# Altium project Front Row.PrjPcb
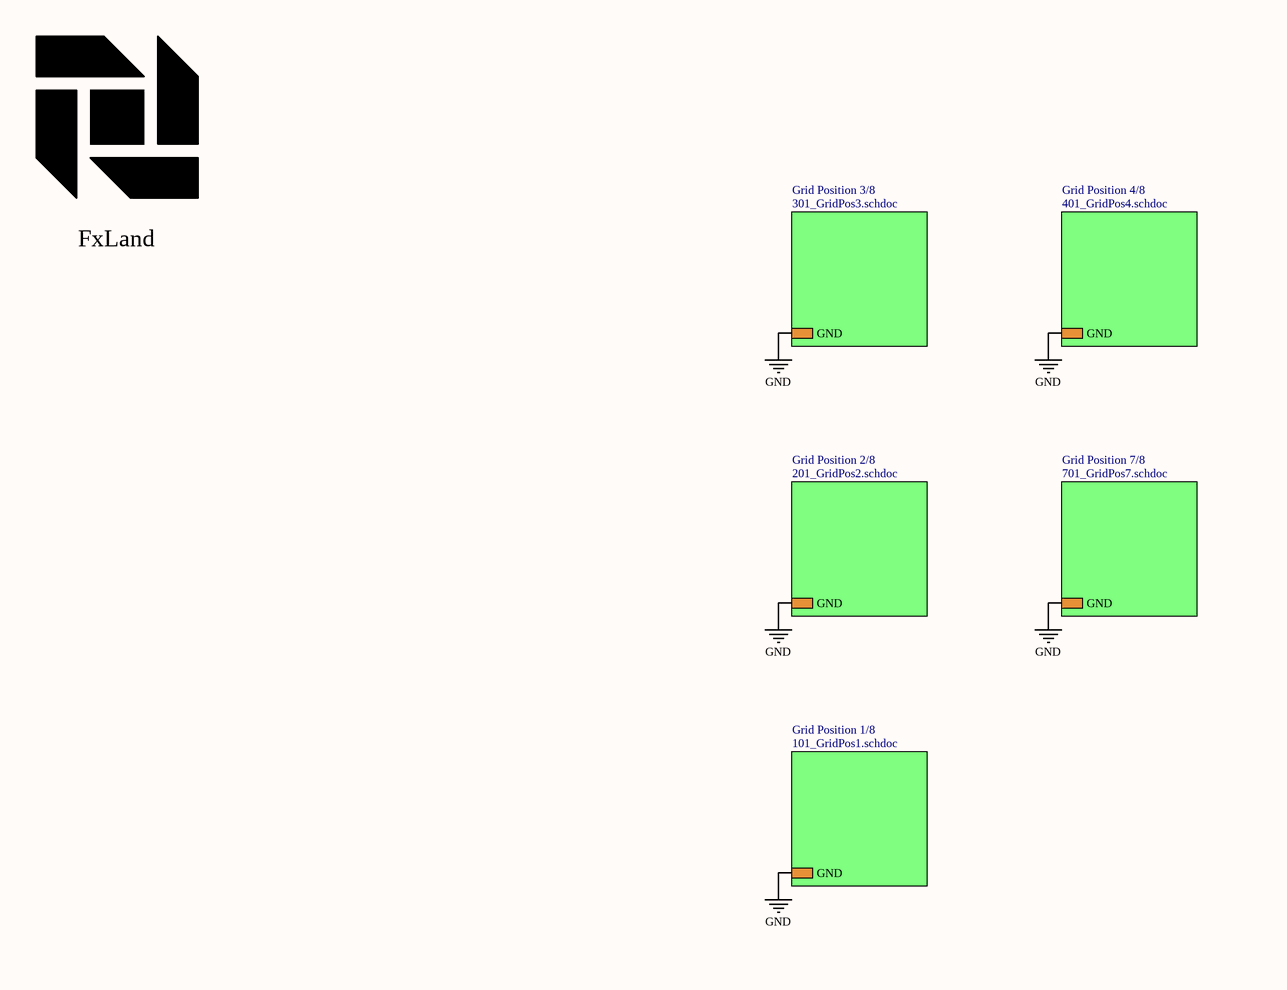
[diagram p0: 100_top.SchDoc, left]
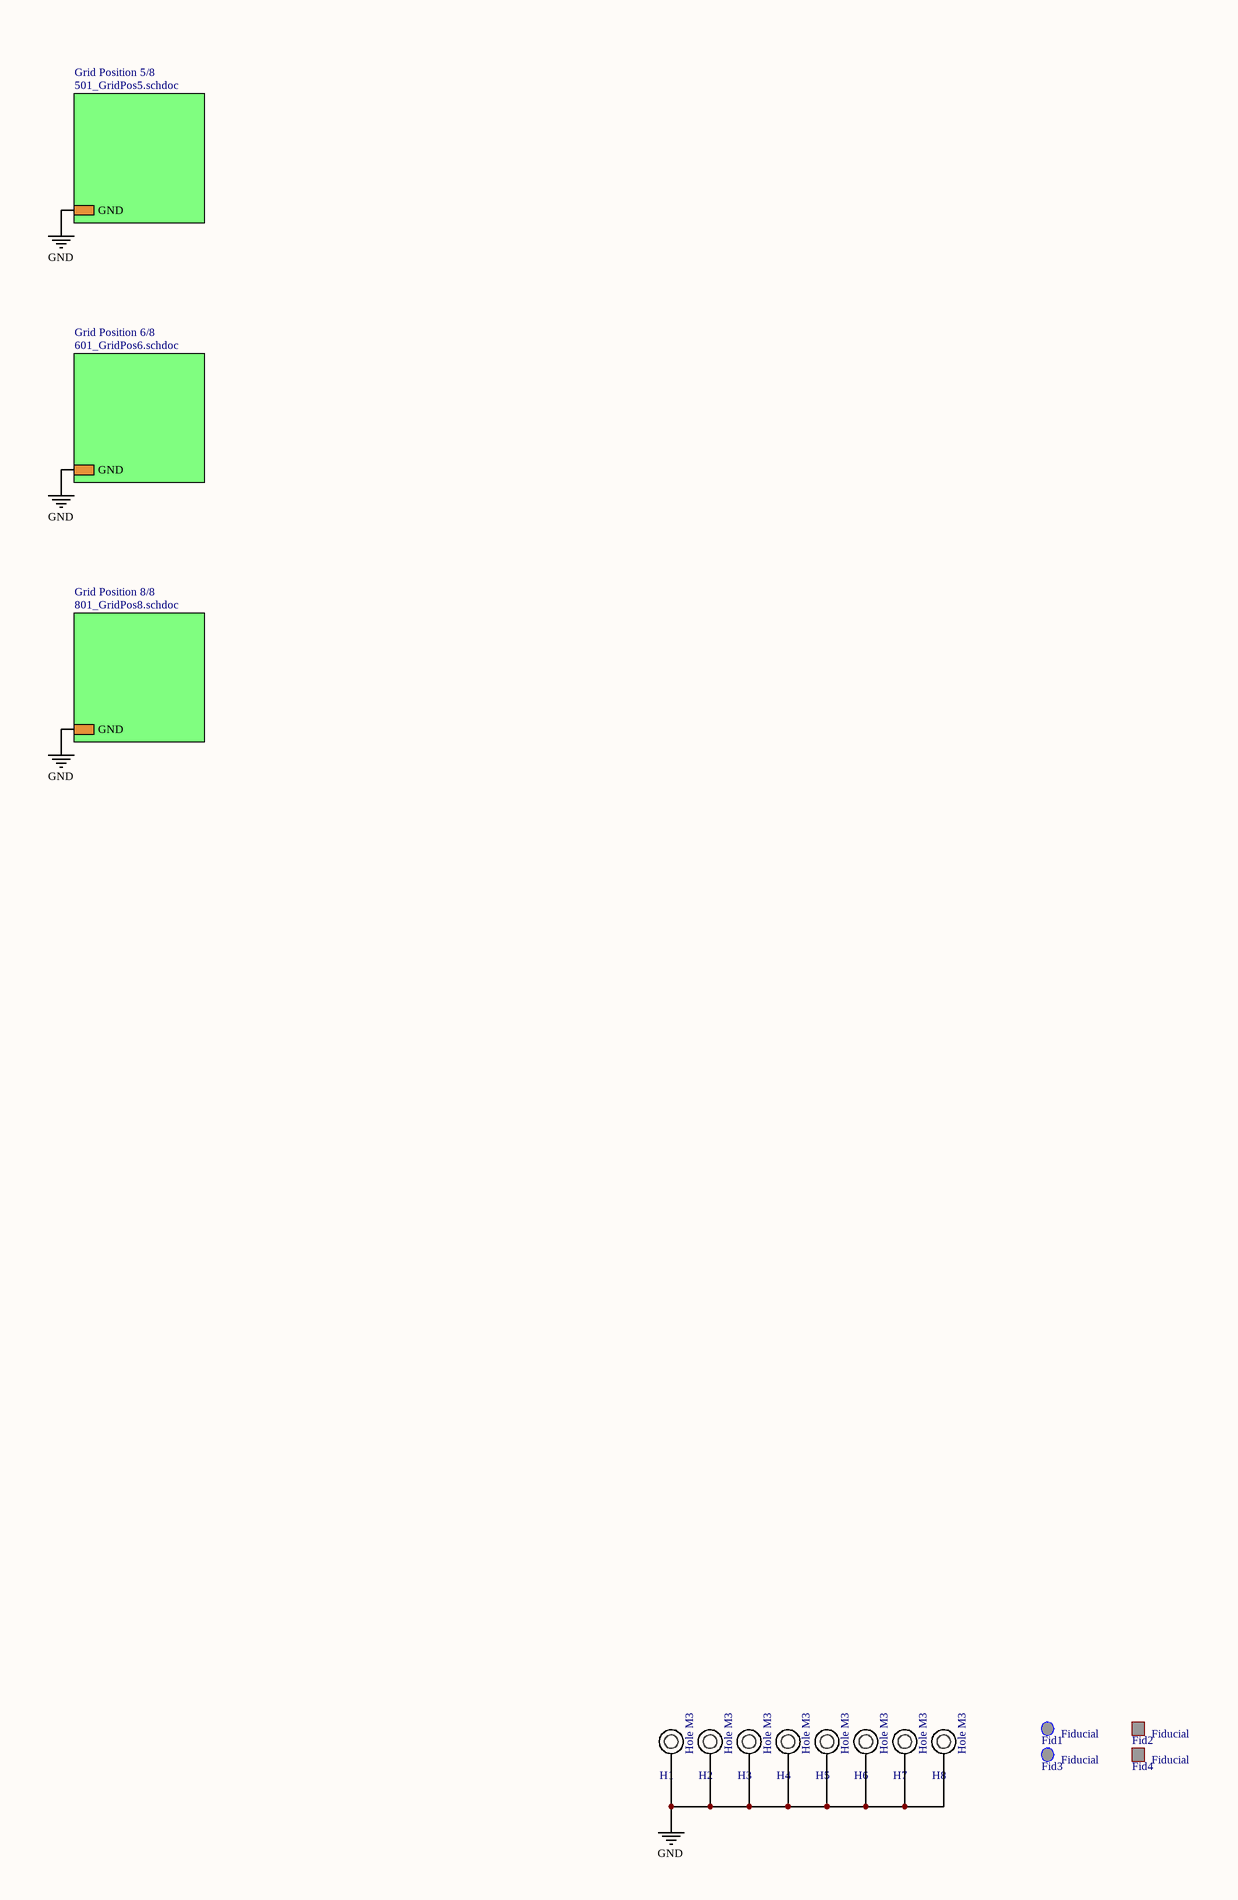
[diagram p1: 100_top.SchDoc, right]
DocNumber: P234; PrName: Grid part 1; Rev: 1.8
9 sheets, 29 parts. Net scope: hierarchical (ports join the sheet entries above them; power ports are global).
Board file: Front Row.PcbDoc
Sheets:
  100_top.SchDoc
    Grid Position 1/8 = 101_GridPos1.SchDoc
    Grid Position 2/8 = 201_GridPos2.SchDoc
    Grid Position 4/8 = 401_GridPos4.SchDoc
    Grid Position 5/8 = 501_GridPos5.SchDoc
    Grid Position 3/8 = 301_GridPos3.SchDoc
    Grid Position 6/8 = 601_GridPos6.SchDoc
    Grid Position 7/8 = 701_GridPos7.SchDoc
    Grid Position 8/8 = 801_GridPos8.SchDoc

## Sheet 100_top.SchDoc
size A2; Organization: Greenfield Tech Solutions; Address1: Molendreef 33; Address2: Ossendrecht; Address3: 4641CS; Address4: The Netherlands; DocumentNumber: P234; Revision: 1.8; SheetNumber: 1; SheetTotal: 9

### Parts
Fid1  Fiducial  [FidR_1.0mm]
Fid2  Fiducial  [FidS_1.0mm]
Fid3  Fiducial  [FidR_1.0mm]
Fid4  Fiducial  [FidS_1.0mm]
H1  Hole M3  [HOLE_M3]
H2  Hole M3  [HOLE_M3]
H3  Hole M3  [HOLE_M3]
H4  Hole M3  [HOLE_M3]
H5  Hole M3  [HOLE_M3]
H6  Hole M3  [HOLE_M3]
H7  Hole M3  [HOLE_M3]
H8  Hole M3  [HOLE_M3]
Logo_FxLand1  FxLand  [Logo_FxLand_3]  (value not drawn)

### Sub-sheets
Grid Position 1/8 = 101_GridPos1.schdoc: GND
Grid Position 2/8 = 201_GridPos2.schdoc: GND
Grid Position 3/8 = 301_GridPos3.schdoc: GND
Grid Position 4/8 = 401_GridPos4.schdoc: GND
Grid Position 5/8 = 501_GridPos5.schdoc: GND
Grid Position 6/8 = 601_GridPos6.schdoc: GND
Grid Position 7/8 = 701_GridPos7.schdoc: GND
Grid Position 8/8 = 801_GridPos8.schdoc: GND

### Nets
GND: H1.1 H2.1 H3.1 H4.1 H5.1 H6.1 H7.1 H8.1 ; sheet Grid Position 1/8/GND, sheet Grid Position 2/8/GND, sheet Grid Position 4/8/GND, sheet Grid Position 5/8/GND, sheet Grid Position 3/8/GND, sheet Grid Position 6/8/GND, sheet Grid Position 7/8/GND, sheet Grid Position 8/8/GND

### Notes on the sheet
- Title
- Size:
- Date:
- File:
- A2
- Number:
- Time:
- Revision:
- Sheet
- of

### Library data of the parts
Fid1 Fid3 = ME0011: Fiducial Round 1mm; Part Number: ME0011; ID: 11; RefVal: Fiducial
Fid2 Fid4 = ME0012: Fiducial Sqaure 1mm; Part Number: ME0012; ID: 12; RefVal: Fiducial
H1-H8 = ME0001: Mounting Hole M3; Part Number: ME0001; ID: 1; RefVal: Hole M3
Logo_FxLand1 = ME0008: Logo FxLand 3; Part Number: ME0008; ID: 8; RefVal: FxLand

## Sheet 101_GridPos1.SchDoc: Grid Position 1 / USB 0
size A2; Organization: Greenfield Tech Solutions; Address1: Molendreef 33; Address2: Ossendrecht; Address3: 4641CS; Address4: The Netherlands; DocumentNumber: P234; Revision: 1.8; SheetNumber: 2; SheetTotal: 9
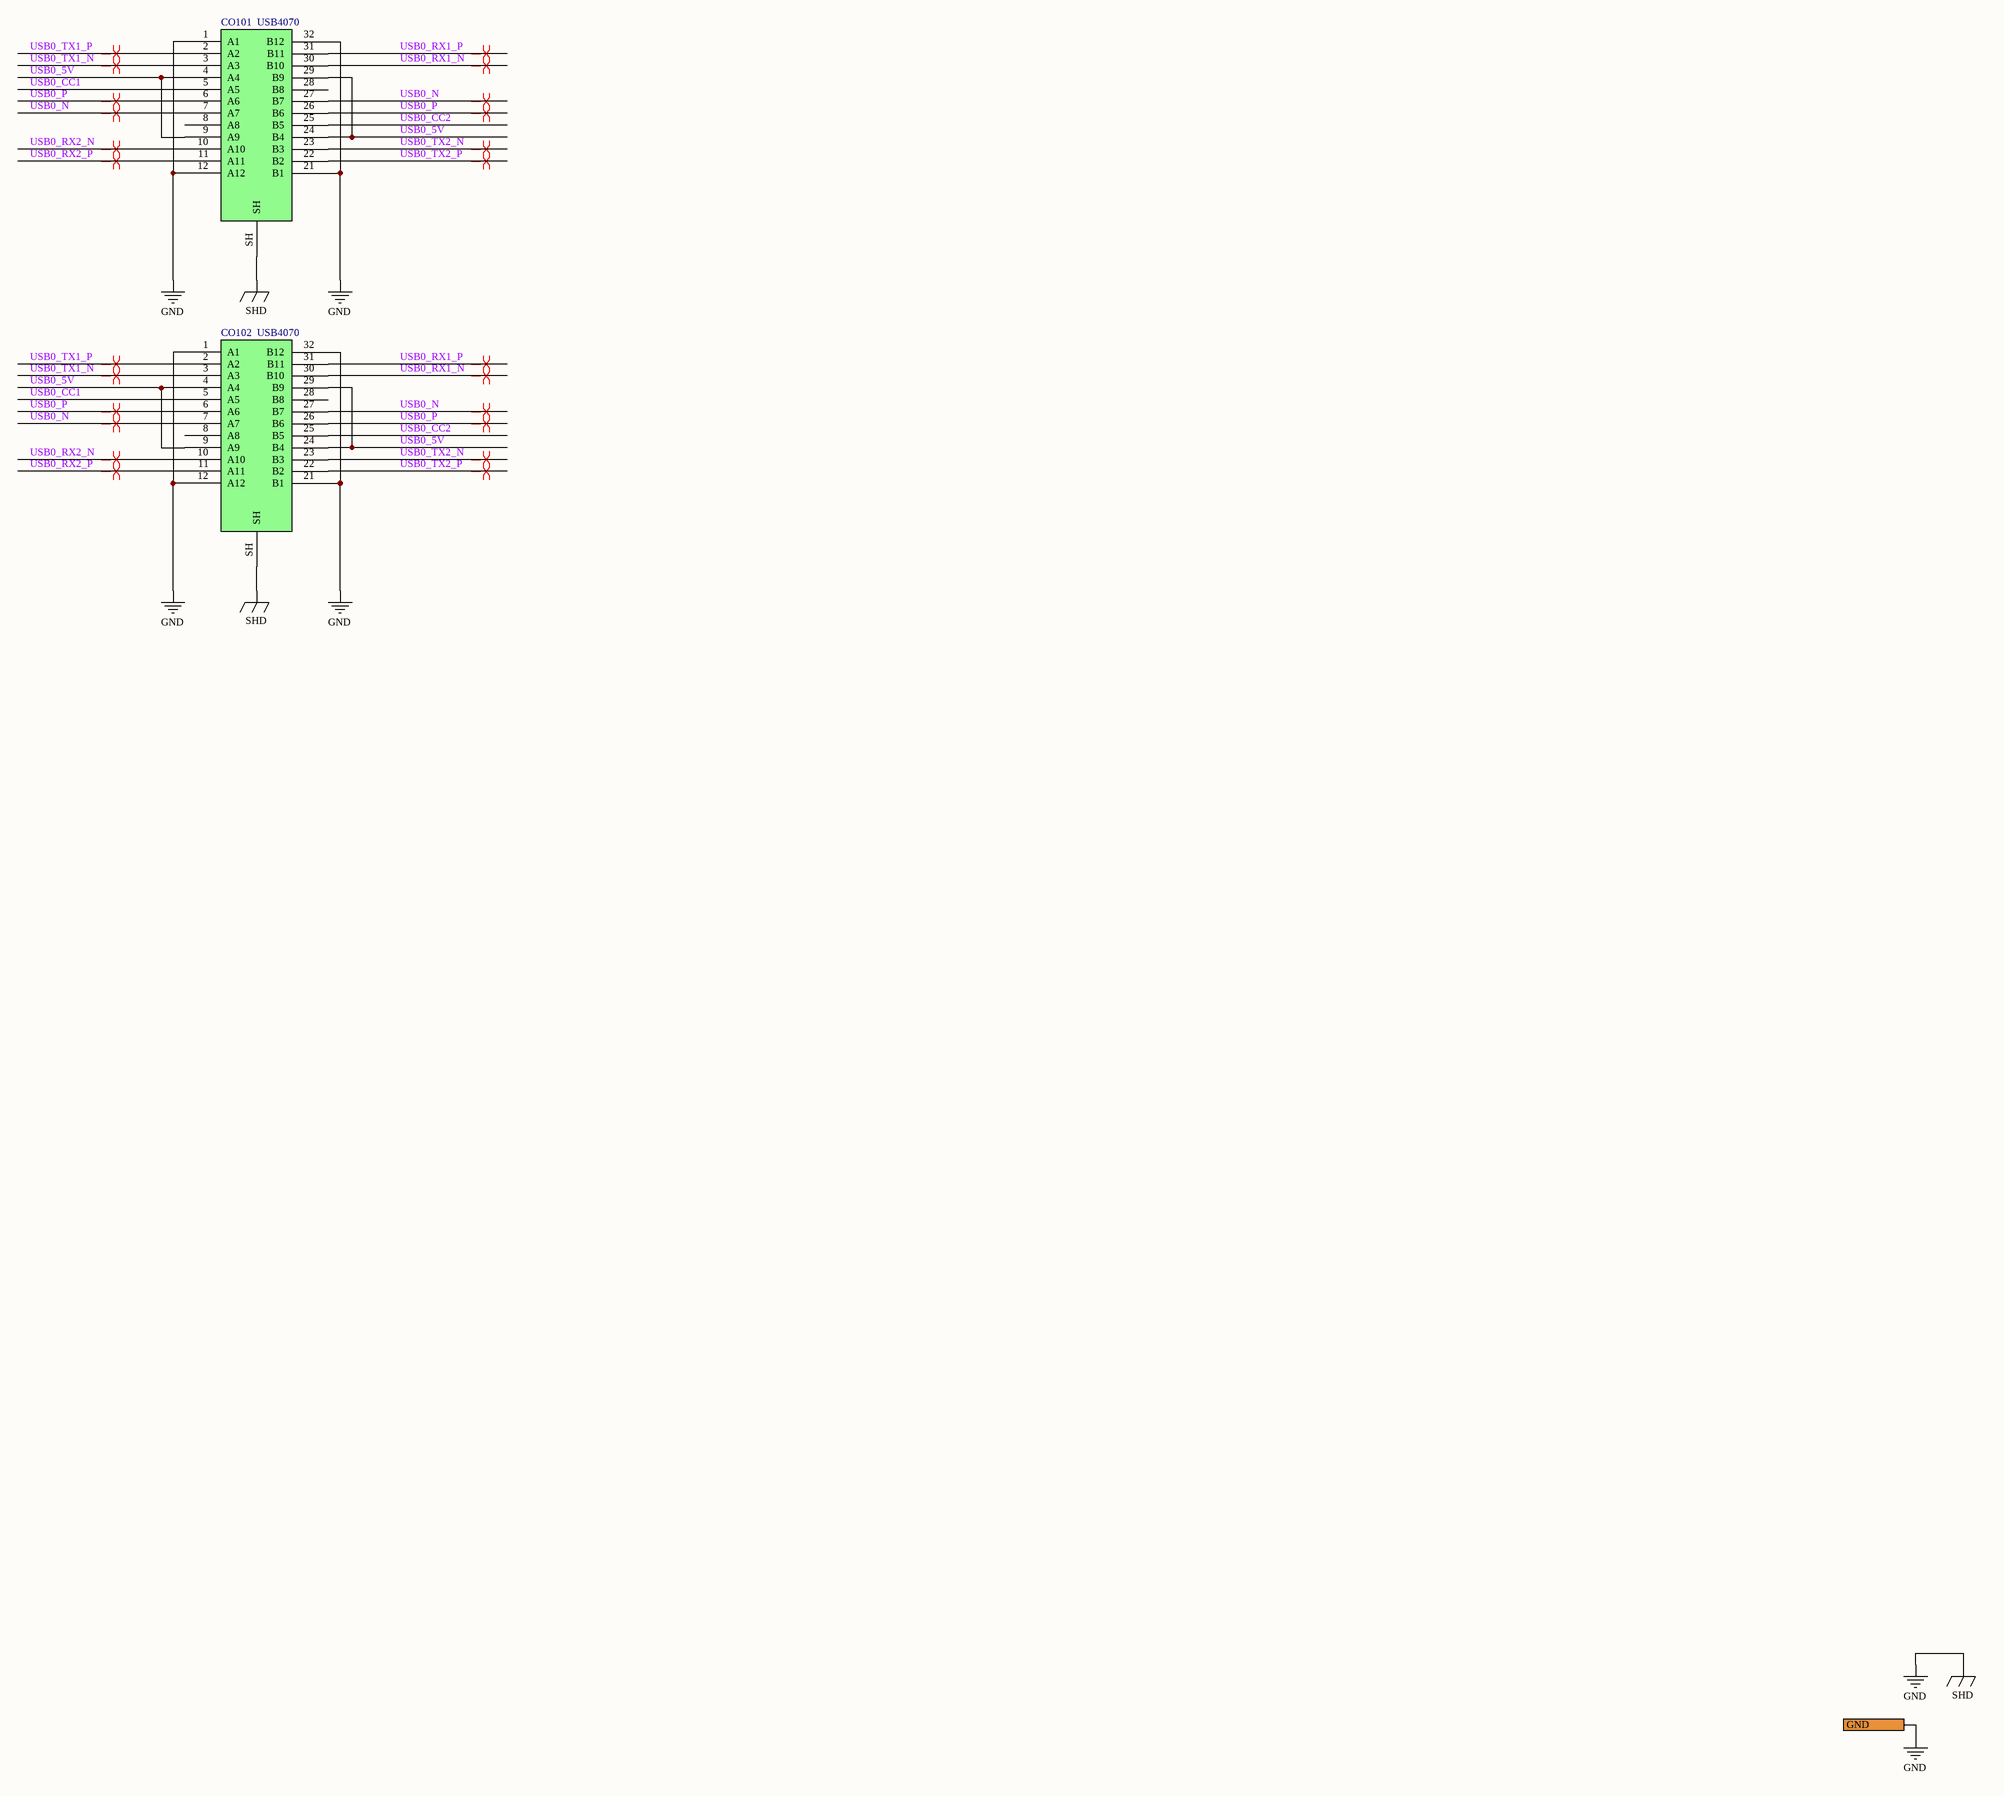
[diagram p2: 101_GridPos1.SchDoc]

### Parts
CO101  USB4070  [USB4070-30-C]
CO102  USB4070  [USB4070-30-C]

### Ports
GND

### Nets
GND: CO101.1(A1) CO101.12(A12) CO101.21(B1) CO101.32(B12) CO101.SH CO102.1(A1) CO102.12(A12) CO102.21(B1) CO102.32(B12) CO102.SH ; port GND  [also labelled SHD]
USB0_5V: CO101.4(A4) CO101.9(A9) CO101.24(B4) CO101.29(B9) CO102.4(A4) CO102.9(A9) CO102.24(B4) CO102.29(B9)
USB0_CC1: CO101.5(A5) CO102.5(A5)
USB0_CC2: CO101.25(B5) CO102.25(B5)
USB0_N: CO101.7(A7) CO101.27(B7) CO102.7(A7) CO102.27(B7)
USB0_P: CO101.6(A6) CO101.26(B6) CO102.6(A6) CO102.26(B6)
USB0_RX1_N: CO101.30(B10) CO102.30(B10)
USB0_RX1_P: CO101.31(B11) CO102.31(B11)
USB0_RX2_N: CO101.10(A10) CO102.10(A10)
USB0_RX2_P: CO101.11(A11) CO102.11(A11)
USB0_TX1_N: CO101.3(A3) CO102.3(A3)
USB0_TX1_P: CO101.2(A2) CO102.2(A2)
USB0_TX2_N: CO101.23(B3) CO102.23(B3)
USB0_TX2_P: CO101.22(B2) CO102.22(B2)

Not connected (* = marked no-connect by the designer): CO101 8(A8) 28(B8); CO102 8(A8) 28(B8)

### Layout directives
differential pair; differential pair class USB3: USB0_N, USB0_P, USB0_RX1_N, USB0_RX1_P, USB0_RX2_N, USB0_RX2_P, USB0_TX1_N, USB0_TX1_P, USB0_TX2_N, USB0_TX2_P

### Notes on the sheet
- Title
- Size:
- Date:
- File:
- A2
- Number:
- Time:
- Revision:
- Sheet
- of

### Library data of the parts
CO101 CO102 = CO0021: USB4070-30-C; Part Number: CO0021; ID: 16; RefVal: USB4070; ManfactPart: USB4070-30-C

## Sheet 201_GridPos2.SchDoc: Grid Position 2 / USB 1
size A2; Organization: Greenfield Tech Solutions; Address1: Molendreef 33; Address2: Ossendrecht; Address3: 4641CS; Address4: The Netherlands; DocumentNumber: P234; Revision: 1.8; SheetNumber: 3; SheetTotal: 9
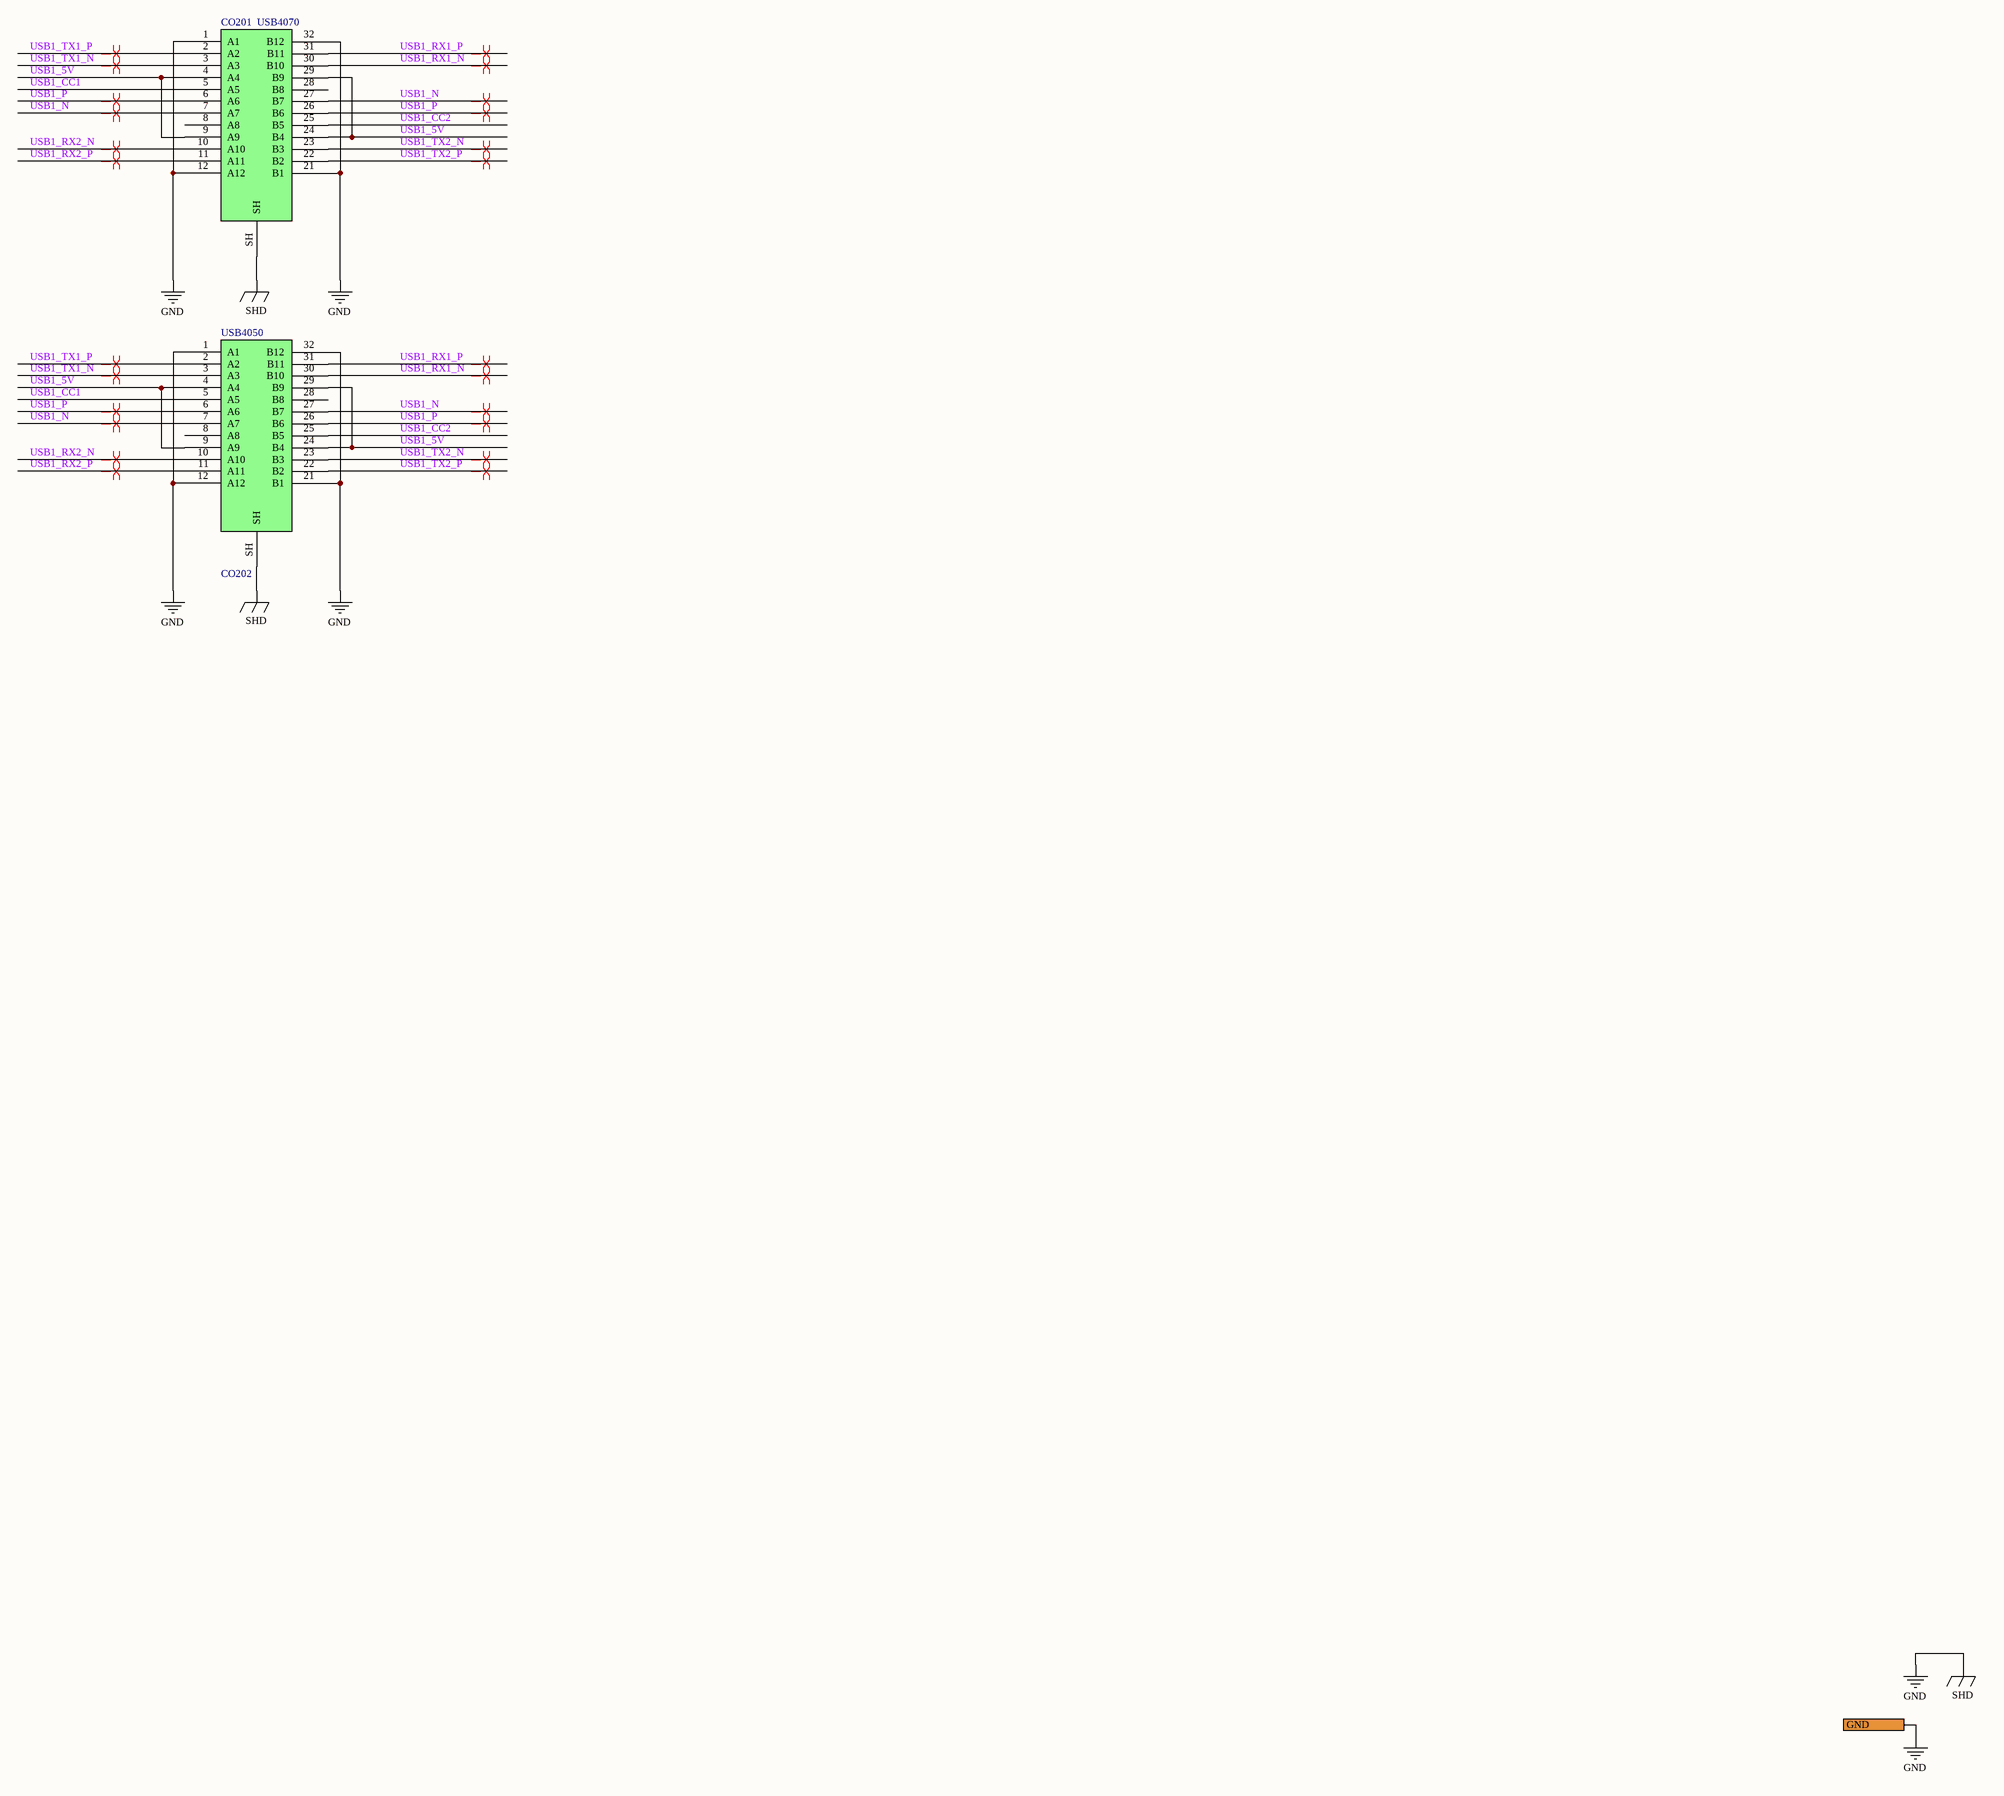
[diagram p3: 201_GridPos2.SchDoc]

### Parts
CO201  USB4070  [USB4070-30-C]
CO202  USB4050  [USB4050-30-A]

### Ports
GND

### Nets
GND: CO201.1(A1) CO201.12(A12) CO201.21(B1) CO201.32(B12) CO201.SH CO202.1(A1) CO202.12(A12) CO202.21(B1) CO202.32(B12) CO202.SH ; port GND  [also labelled SHD]
USB1_5V: CO201.4(A4) CO201.9(A9) CO201.24(B4) CO201.29(B9) CO202.4(A4) CO202.9(A9) CO202.24(B4) CO202.29(B9)
USB1_CC1: CO201.5(A5) CO202.5(A5)
USB1_CC2: CO201.25(B5) CO202.25(B5)
USB1_N: CO201.7(A7) CO201.27(B7) CO202.7(A7) CO202.27(B7)
USB1_P: CO201.6(A6) CO201.26(B6) CO202.6(A6) CO202.26(B6)
USB1_RX1_N: CO201.30(B10) CO202.30(B10)
USB1_RX1_P: CO201.31(B11) CO202.31(B11)
USB1_RX2_N: CO201.10(A10) CO202.10(A10)
USB1_RX2_P: CO201.11(A11) CO202.11(A11)
USB1_TX1_N: CO201.3(A3) CO202.3(A3)
USB1_TX1_P: CO201.2(A2) CO202.2(A2)
USB1_TX2_N: CO201.23(B3) CO202.23(B3)
USB1_TX2_P: CO201.22(B2) CO202.22(B2)

Not connected (* = marked no-connect by the designer): CO201 8(A8) 28(B8); CO202 8(A8) 28(B8)

### Layout directives
differential pair; differential pair class USB3: USB1_N, USB1_P, USB1_RX1_N, USB1_RX1_P, USB1_RX2_N, USB1_RX2_P, USB1_TX1_N, USB1_TX1_P, USB1_TX2_N, USB1_TX2_P

### Notes on the sheet
- Title
- Size:
- Date:
- File:
- A2
- Number:
- Time:
- Revision:
- Sheet
- of

### Library data of the parts
CO201 = CO0021: as CO101 on sheet 101_GridPos1; RefVal: USB4070; ManfactPart: USB4070-30-C
CO202 = CO0039: USB C connector Receptacle Horizontal; Part Number: CO0039; ID: 39; RefVal: USB4050; ManfactPart: USB4050-30-A

## Sheet 401_GridPos4.SchDoc: Grid Position 4 / USB 3
size A2; Organization: Greenfield Tech Solutions; Address1: Molendreef 33; Address2: Ossendrecht; Address3: 4641CS; Address4: The Netherlands; DocumentNumber: P234; Revision: 1.8; SheetNumber: 5; SheetTotal: 9
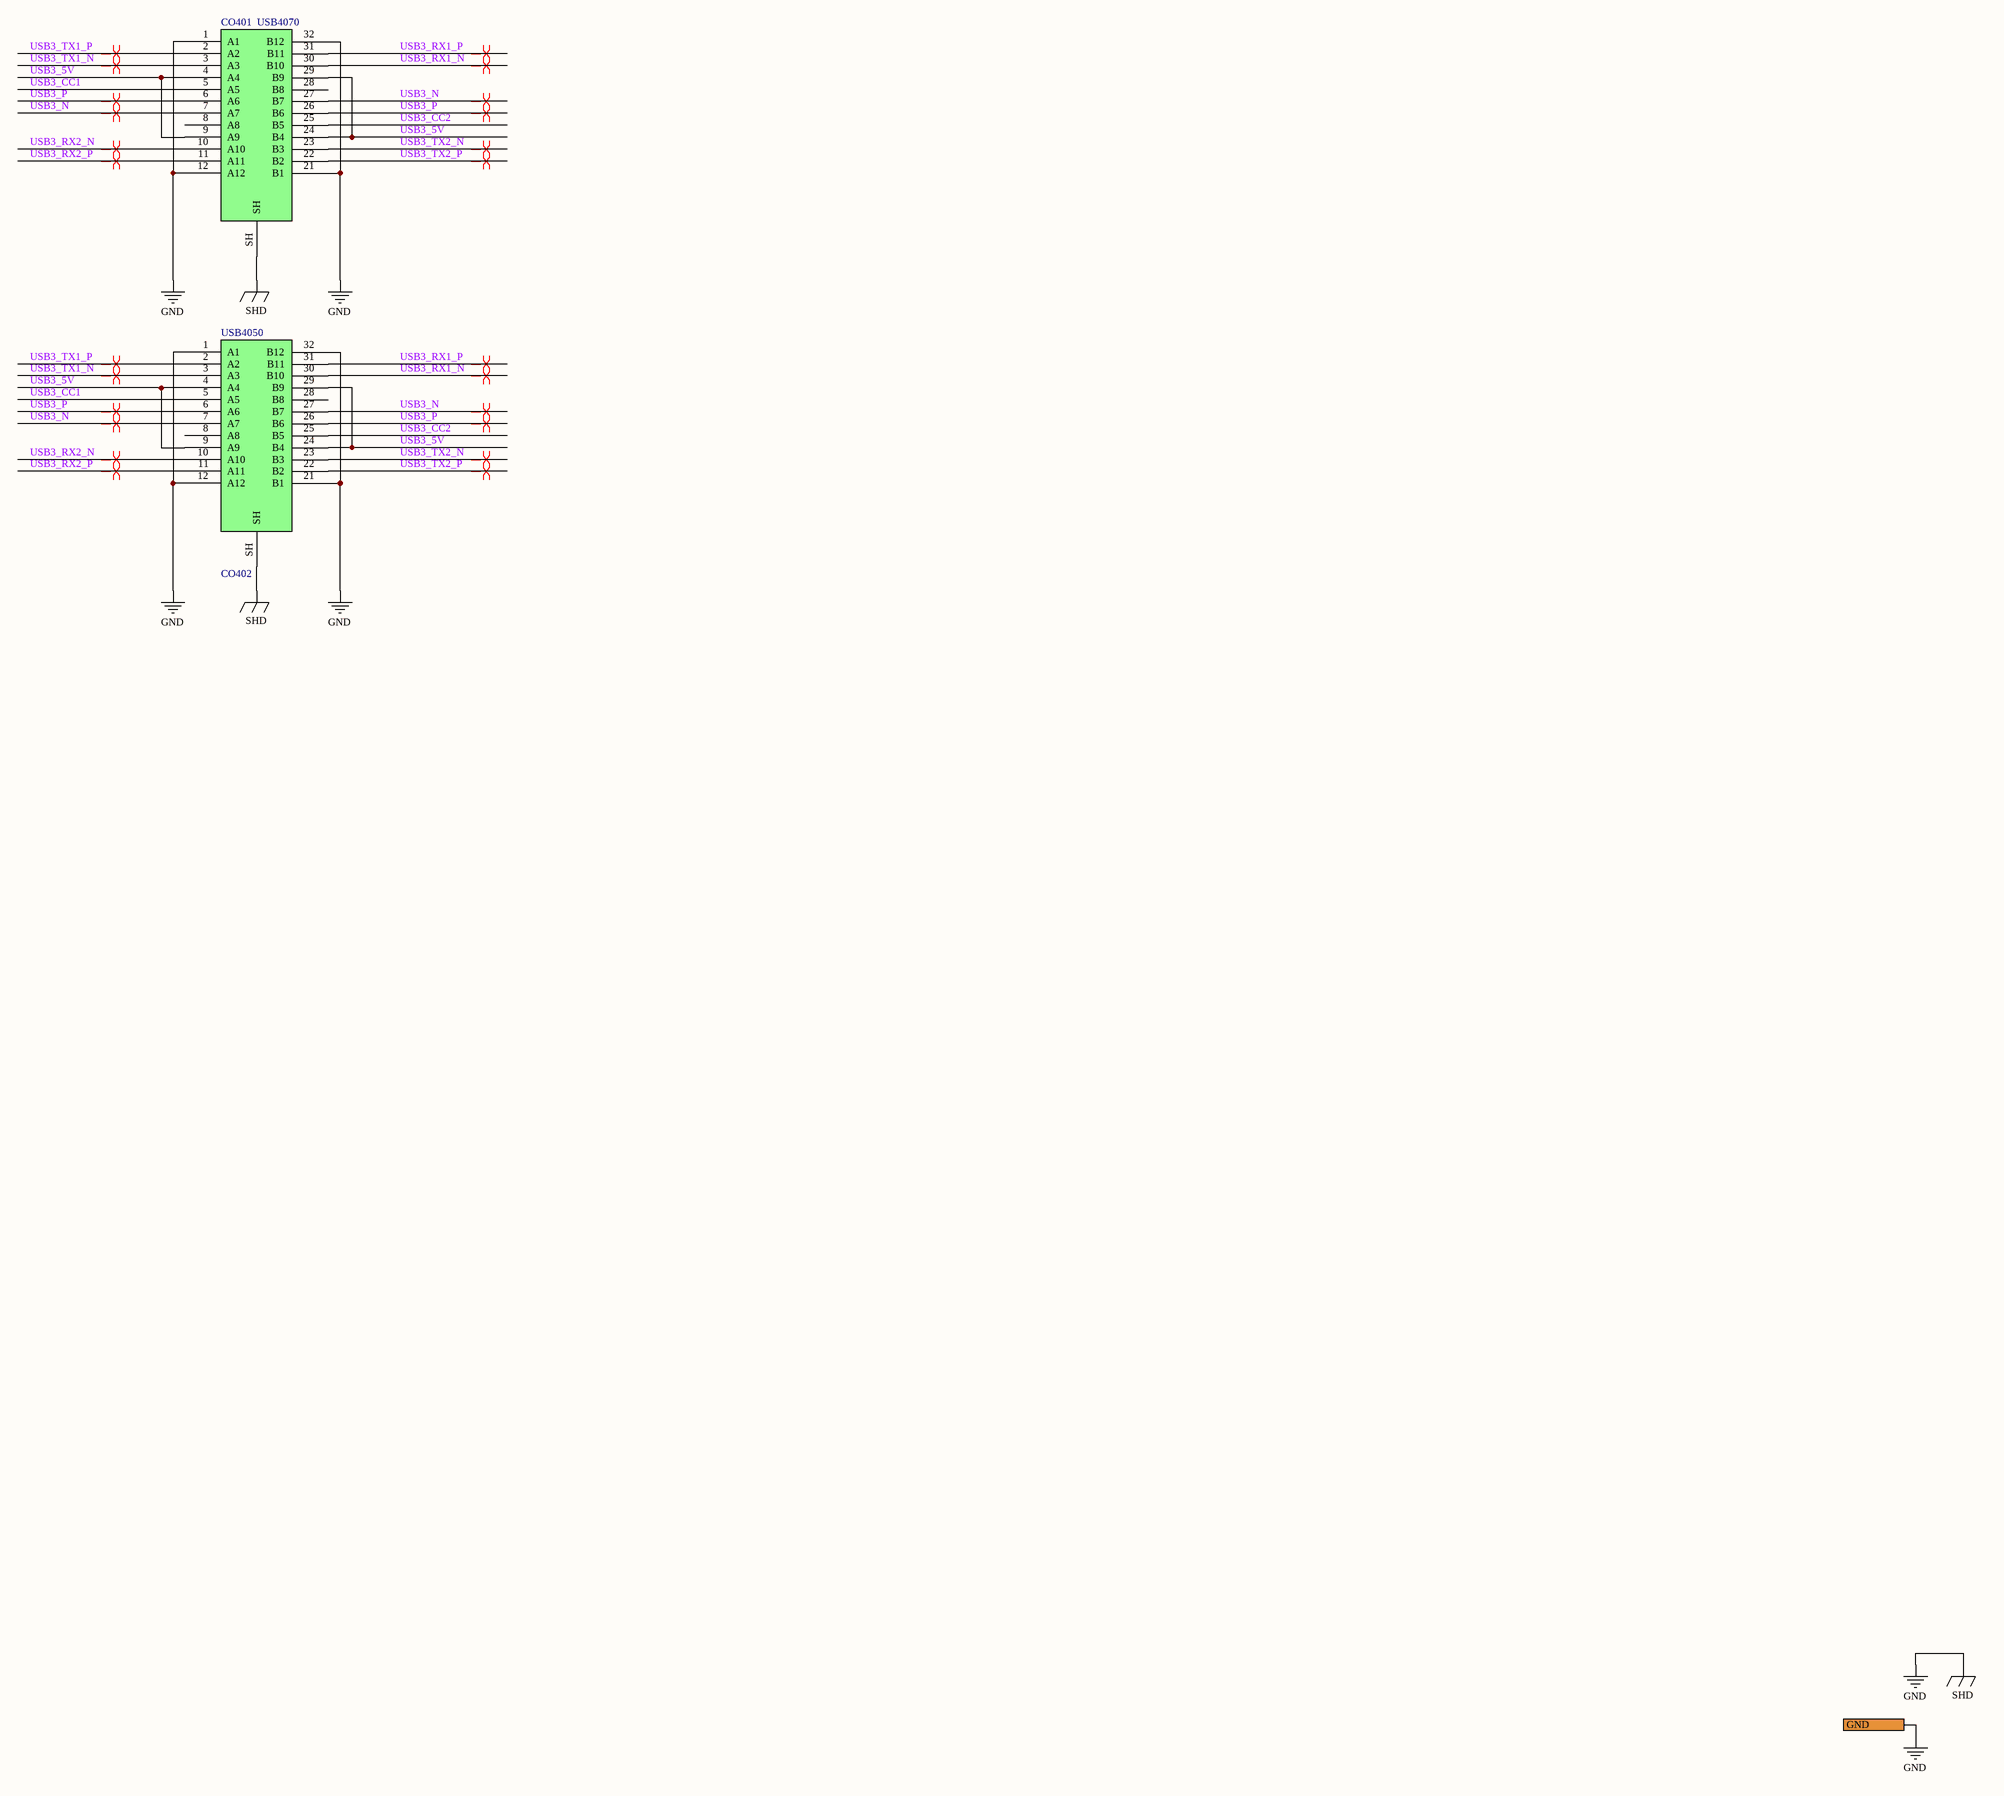
[diagram p4: 401_GridPos4.SchDoc]

### Parts
CO401  USB4070  [USB4070-30-C]
CO402  USB4050  [USB4050-30-A]

### Ports
GND

### Nets
GND: CO401.1(A1) CO401.12(A12) CO401.21(B1) CO401.32(B12) CO401.SH CO402.1(A1) CO402.12(A12) CO402.21(B1) CO402.32(B12) CO402.SH ; port GND  [also labelled SHD]
USB3_5V: CO401.4(A4) CO401.9(A9) CO401.24(B4) CO401.29(B9) CO402.4(A4) CO402.9(A9) CO402.24(B4) CO402.29(B9)
USB3_CC1: CO401.5(A5) CO402.5(A5)
USB3_CC2: CO401.25(B5) CO402.25(B5)
USB3_N: CO401.7(A7) CO401.27(B7) CO402.7(A7) CO402.27(B7)
USB3_P: CO401.6(A6) CO401.26(B6) CO402.6(A6) CO402.26(B6)
USB3_RX1_N: CO401.30(B10) CO402.30(B10)
USB3_RX1_P: CO401.31(B11) CO402.31(B11)
USB3_RX2_N: CO401.10(A10) CO402.10(A10)
USB3_RX2_P: CO401.11(A11) CO402.11(A11)
USB3_TX1_N: CO401.3(A3) CO402.3(A3)
USB3_TX1_P: CO401.2(A2) CO402.2(A2)
USB3_TX2_N: CO401.23(B3) CO402.23(B3)
USB3_TX2_P: CO401.22(B2) CO402.22(B2)

Not connected (* = marked no-connect by the designer): CO401 8(A8) 28(B8); CO402 8(A8) 28(B8)

### Layout directives
differential pair; differential pair class USB3: USB3_N, USB3_P, USB3_RX1_N, USB3_RX1_P, USB3_RX2_N, USB3_RX2_P, USB3_TX1_N, USB3_TX1_P, USB3_TX2_N, USB3_TX2_P

### Notes on the sheet
- Title
- Size:
- Date:
- File:
- A2
- Number:
- Time:
- Revision:
- Sheet
- of

### Library data of the parts
CO401 = CO0021: as CO101 on sheet 101_GridPos1; RefVal: USB4070; ManfactPart: USB4070-30-C
CO402 = CO0039: as CO202 on sheet 201_GridPos2; RefVal: USB4050; ManfactPart: USB4050-30-A

## Sheet 501_GridPos5.SchDoc: Grid Position 5 / USB 4
size A2; Organization: Greenfield Tech Solutions; Address1: Molendreef 33; Address2: Ossendrecht; Address3: 4641CS; Address4: The Netherlands; DocumentNumber: P234; Revision: 1.8; SheetNumber: 6; SheetTotal: 9
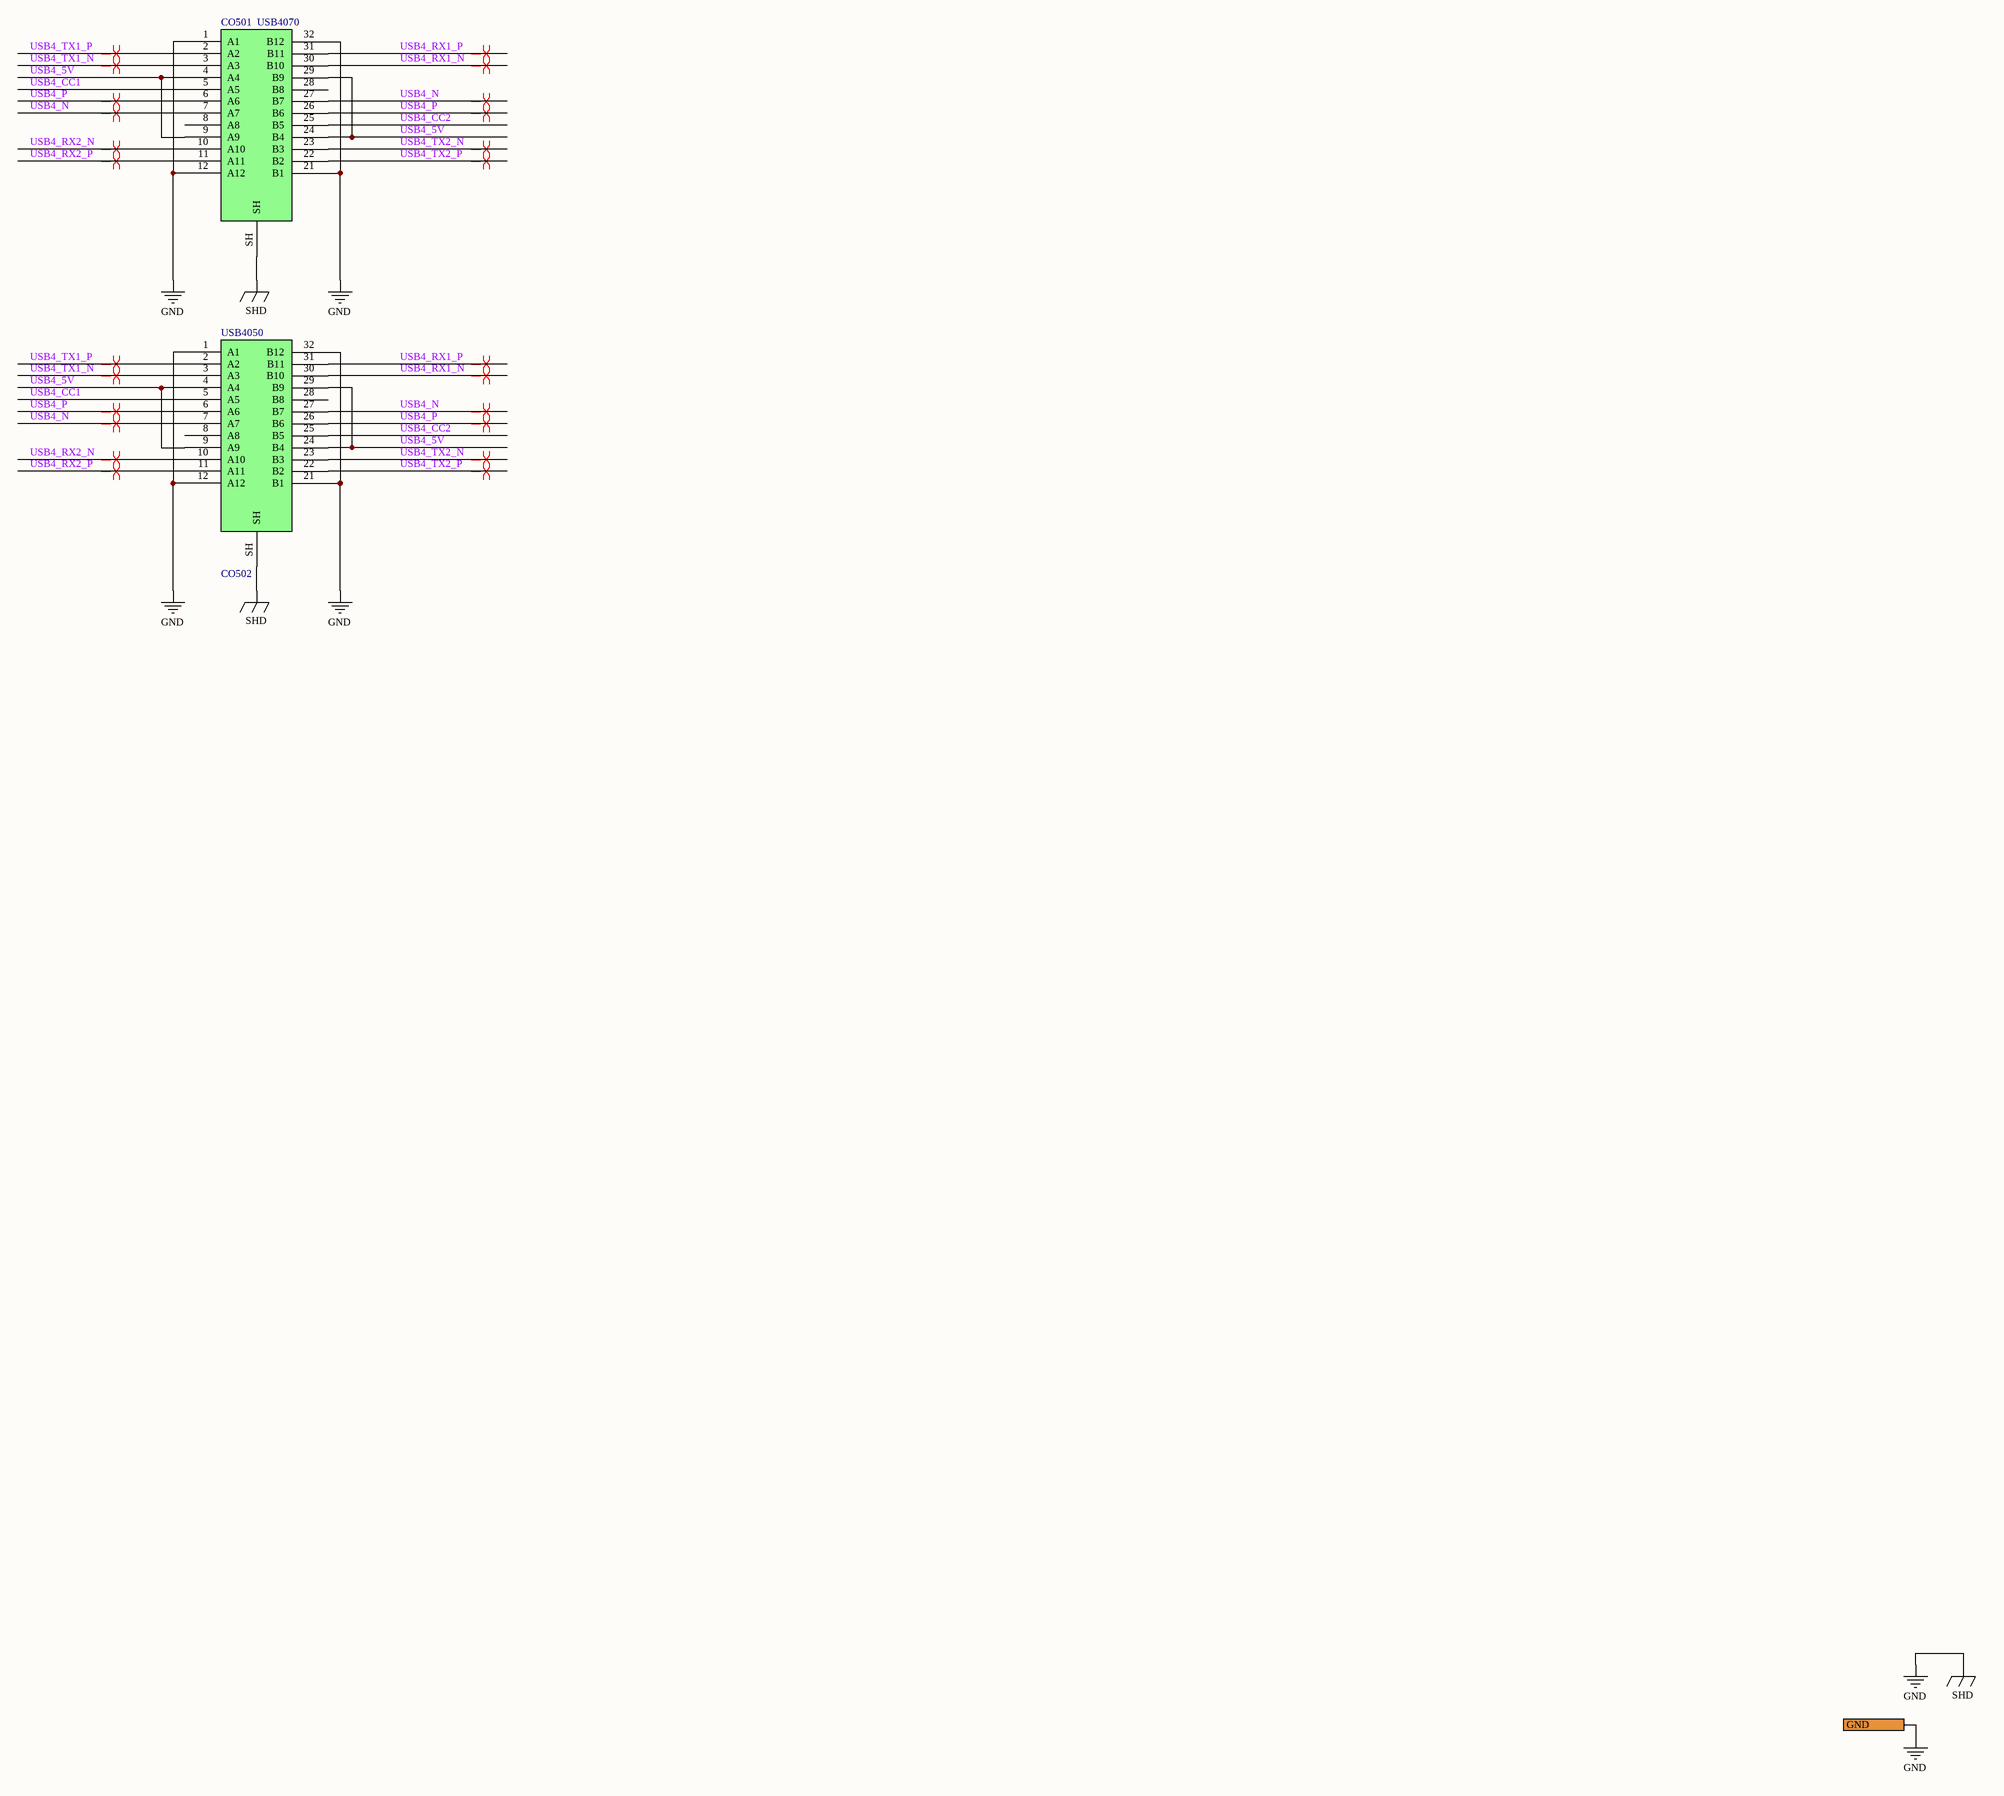
[diagram p5: 501_GridPos5.SchDoc]

### Parts
CO501  USB4070  [USB4070-30-C]
CO502  USB4050  [USB4050-30-A]

### Ports
GND

### Nets
GND: CO501.1(A1) CO501.12(A12) CO501.21(B1) CO501.32(B12) CO501.SH CO502.1(A1) CO502.12(A12) CO502.21(B1) CO502.32(B12) CO502.SH ; port GND  [also labelled SHD]
USB4_5V: CO501.4(A4) CO501.9(A9) CO501.24(B4) CO501.29(B9) CO502.4(A4) CO502.9(A9) CO502.24(B4) CO502.29(B9)
USB4_CC1: CO501.5(A5) CO502.5(A5)
USB4_CC2: CO501.25(B5) CO502.25(B5)
USB4_N: CO501.7(A7) CO501.27(B7) CO502.7(A7) CO502.27(B7)
USB4_P: CO501.6(A6) CO501.26(B6) CO502.6(A6) CO502.26(B6)
USB4_RX1_N: CO501.30(B10) CO502.30(B10)
USB4_RX1_P: CO501.31(B11) CO502.31(B11)
USB4_RX2_N: CO501.10(A10) CO502.10(A10)
USB4_RX2_P: CO501.11(A11) CO502.11(A11)
USB4_TX1_N: CO501.3(A3) CO502.3(A3)
USB4_TX1_P: CO501.2(A2) CO502.2(A2)
USB4_TX2_N: CO501.23(B3) CO502.23(B3)
USB4_TX2_P: CO501.22(B2) CO502.22(B2)

Not connected (* = marked no-connect by the designer): CO501 8(A8) 28(B8); CO502 8(A8) 28(B8)

### Layout directives
differential pair; differential pair class USB3: USB4_N, USB4_P, USB4_RX1_N, USB4_RX1_P, USB4_RX2_N, USB4_RX2_P, USB4_TX1_N, USB4_TX1_P, USB4_TX2_N, USB4_TX2_P

### Notes on the sheet
- Title
- Size:
- Date:
- File:
- A2
- Number:
- Time:
- Revision:
- Sheet
- of

### Library data of the parts
CO501 = CO0021: as CO101 on sheet 101_GridPos1; RefVal: USB4070; ManfactPart: USB4070-30-C
CO502 = CO0039: as CO202 on sheet 201_GridPos2; RefVal: USB4050; ManfactPart: USB4050-30-A

## Sheet 301_GridPos3.SchDoc: Grid Position 3 / USB 2
size A2; Organization: Greenfield Tech Solutions; Address1: Molendreef 33; Address2: Ossendrecht; Address3: 4641CS; Address4: The Netherlands; DocumentNumber: P234; Revision: 1.8; SheetNumber: 4; SheetTotal: 9
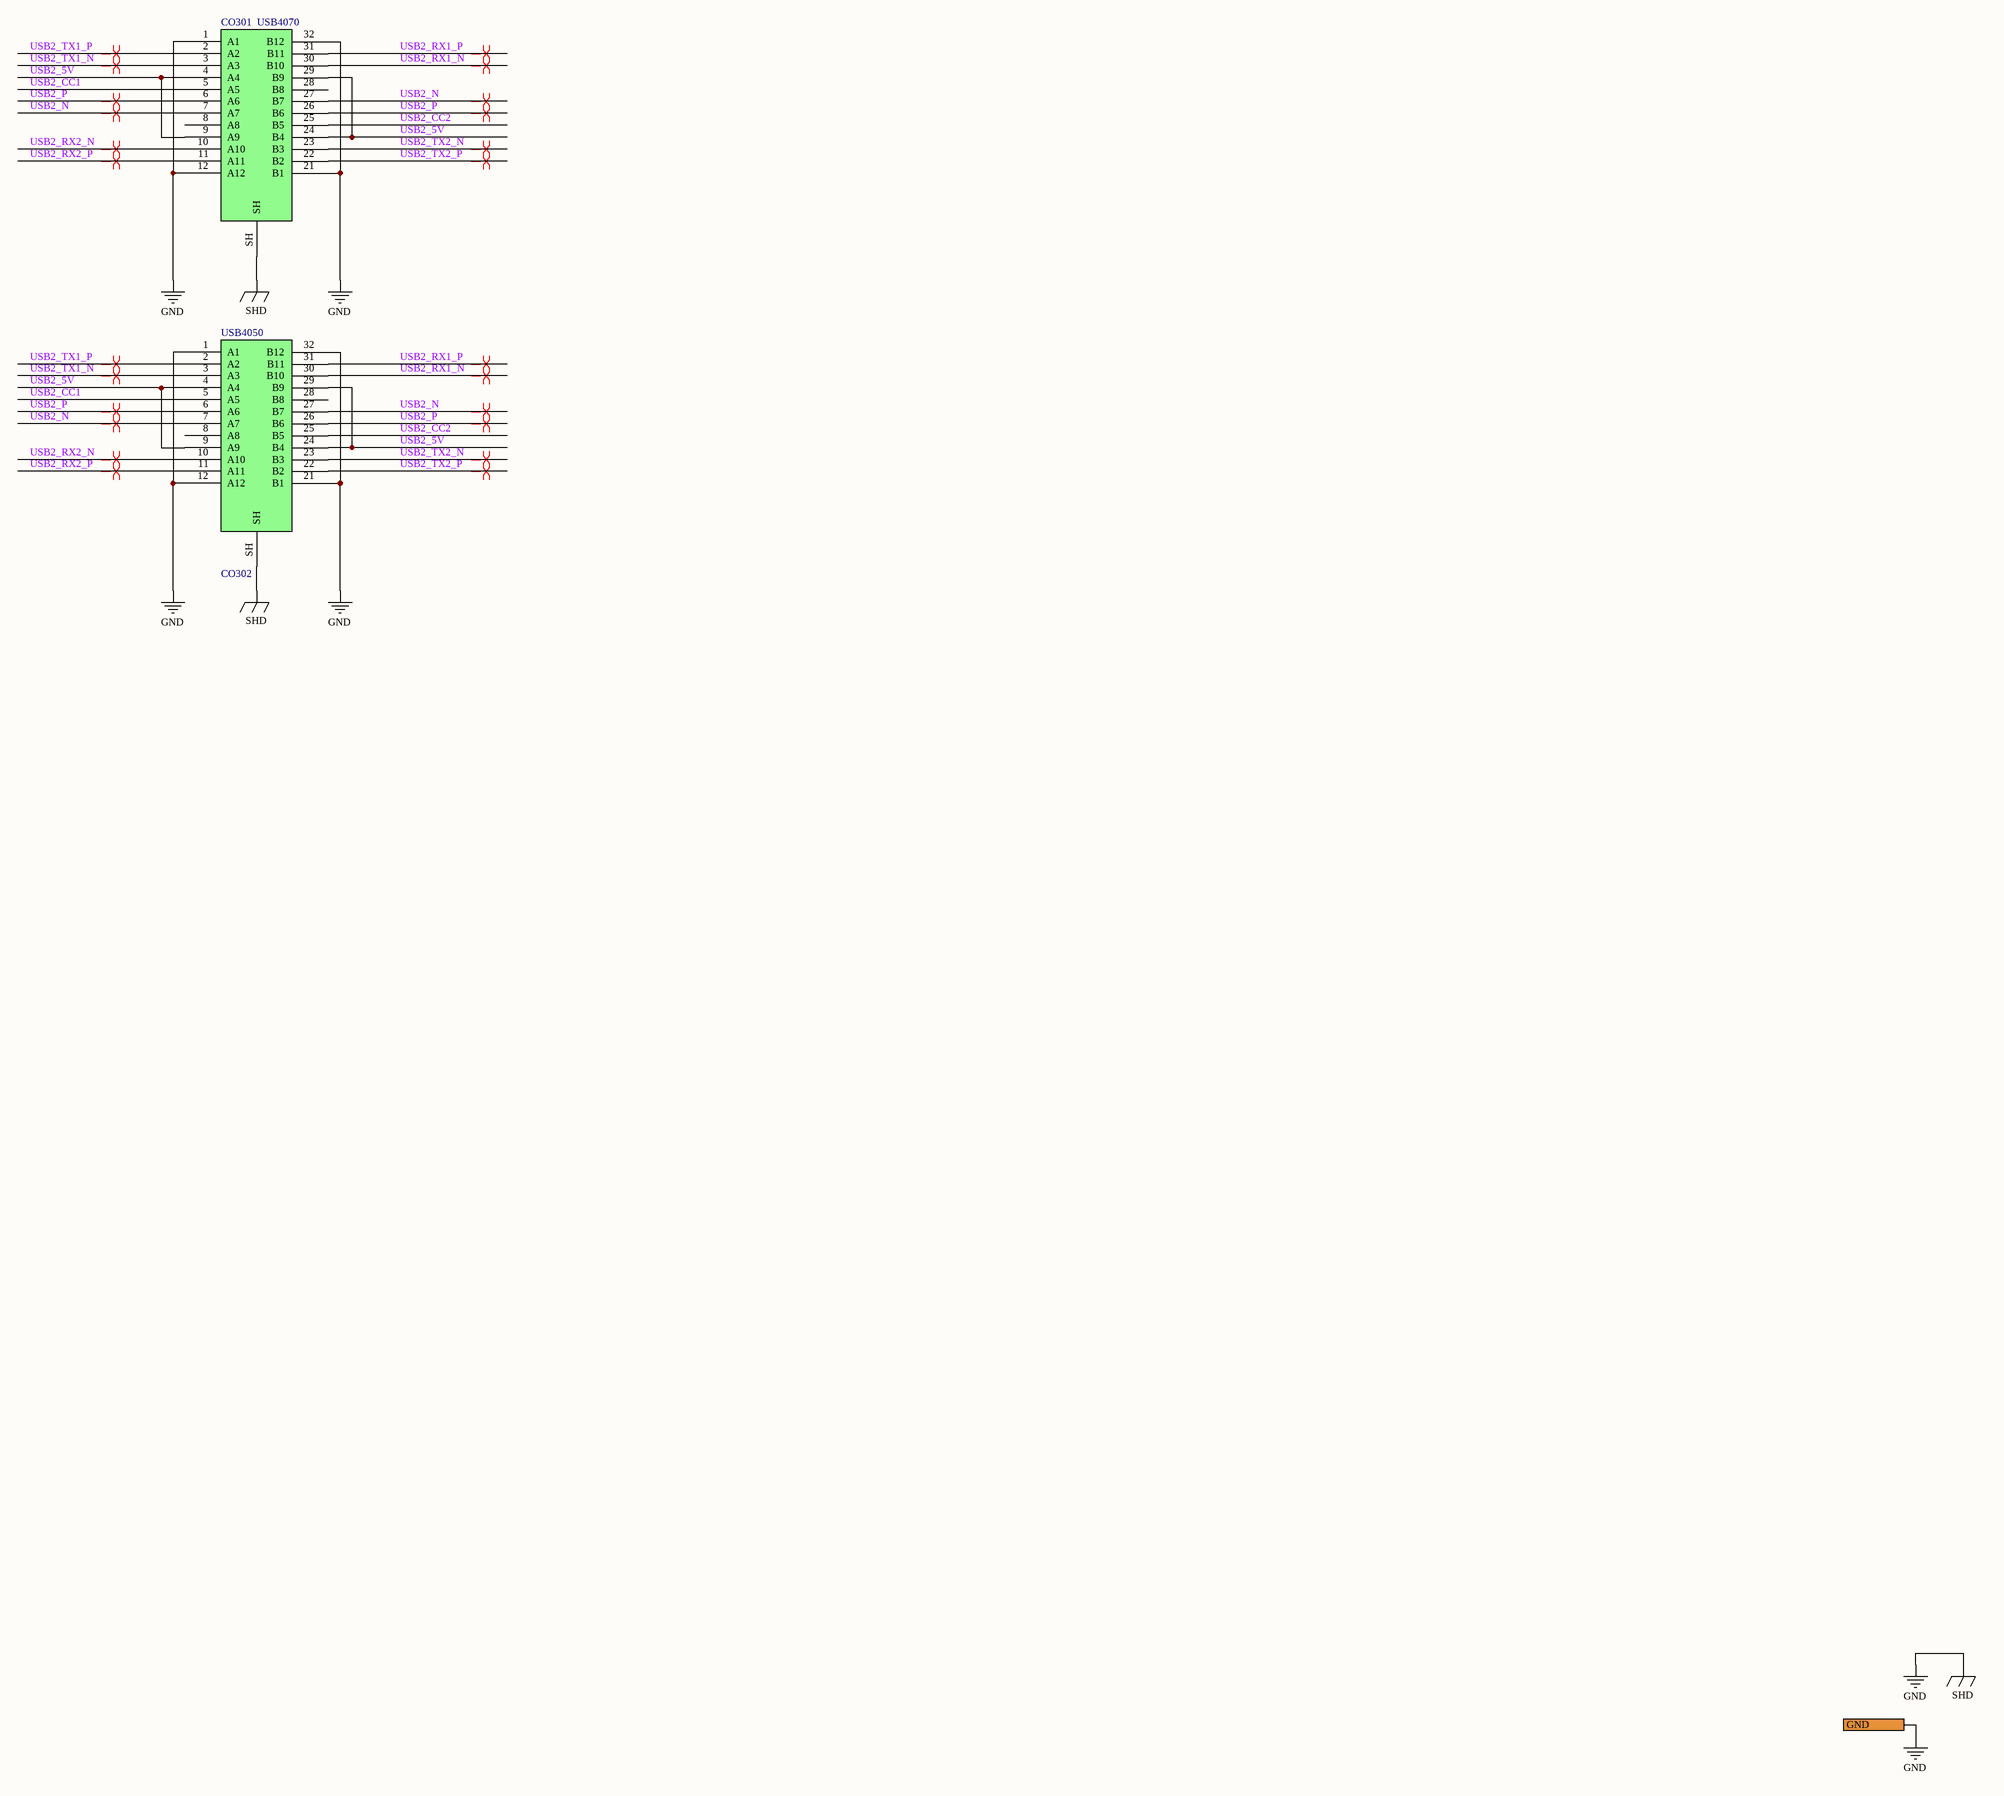
[diagram p6: 301_GridPos3.SchDoc]

### Parts
CO301  USB4070  [USB4070-30-C]
CO302  USB4050  [USB4050-30-A]

### Ports
GND

### Nets
GND: CO301.1(A1) CO301.12(A12) CO301.21(B1) CO301.32(B12) CO301.SH CO302.1(A1) CO302.12(A12) CO302.21(B1) CO302.32(B12) CO302.SH ; port GND  [also labelled SHD]
USB2_5V: CO301.4(A4) CO301.9(A9) CO301.24(B4) CO301.29(B9) CO302.4(A4) CO302.9(A9) CO302.24(B4) CO302.29(B9)
USB2_CC1: CO301.5(A5) CO302.5(A5)
USB2_CC2: CO301.25(B5) CO302.25(B5)
USB2_N: CO301.7(A7) CO301.27(B7) CO302.7(A7) CO302.27(B7)
USB2_P: CO301.6(A6) CO301.26(B6) CO302.6(A6) CO302.26(B6)
USB2_RX1_N: CO301.30(B10) CO302.30(B10)
USB2_RX1_P: CO301.31(B11) CO302.31(B11)
USB2_RX2_N: CO301.10(A10) CO302.10(A10)
USB2_RX2_P: CO301.11(A11) CO302.11(A11)
USB2_TX1_N: CO301.3(A3) CO302.3(A3)
USB2_TX1_P: CO301.2(A2) CO302.2(A2)
USB2_TX2_N: CO301.23(B3) CO302.23(B3)
USB2_TX2_P: CO301.22(B2) CO302.22(B2)

Not connected (* = marked no-connect by the designer): CO301 8(A8) 28(B8); CO302 8(A8) 28(B8)

### Layout directives
differential pair; differential pair class USB3: USB2_N, USB2_P, USB2_RX1_N, USB2_RX1_P, USB2_RX2_N, USB2_RX2_P, USB2_TX1_N, USB2_TX1_P, USB2_TX2_N, USB2_TX2_P

### Notes on the sheet
- Title
- Size:
- Date:
- File:
- A2
- Number:
- Time:
- Revision:
- Sheet
- of

### Library data of the parts
CO301 = CO0021: as CO101 on sheet 101_GridPos1; RefVal: USB4070; ManfactPart: USB4070-30-C
CO302 = CO0039: as CO202 on sheet 201_GridPos2; RefVal: USB4050; ManfactPart: USB4050-30-A

## Sheet 601_GridPos6.SchDoc: Grid Position 6 / USB 5
size A2; Organization: Greenfield Tech Solutions; Address1: Molendreef 33; Address2: Ossendrecht; Address3: 4641CS; Address4: The Netherlands; DocumentNumber: P234; Revision: 1.8; SheetNumber: 7; SheetTotal: 9
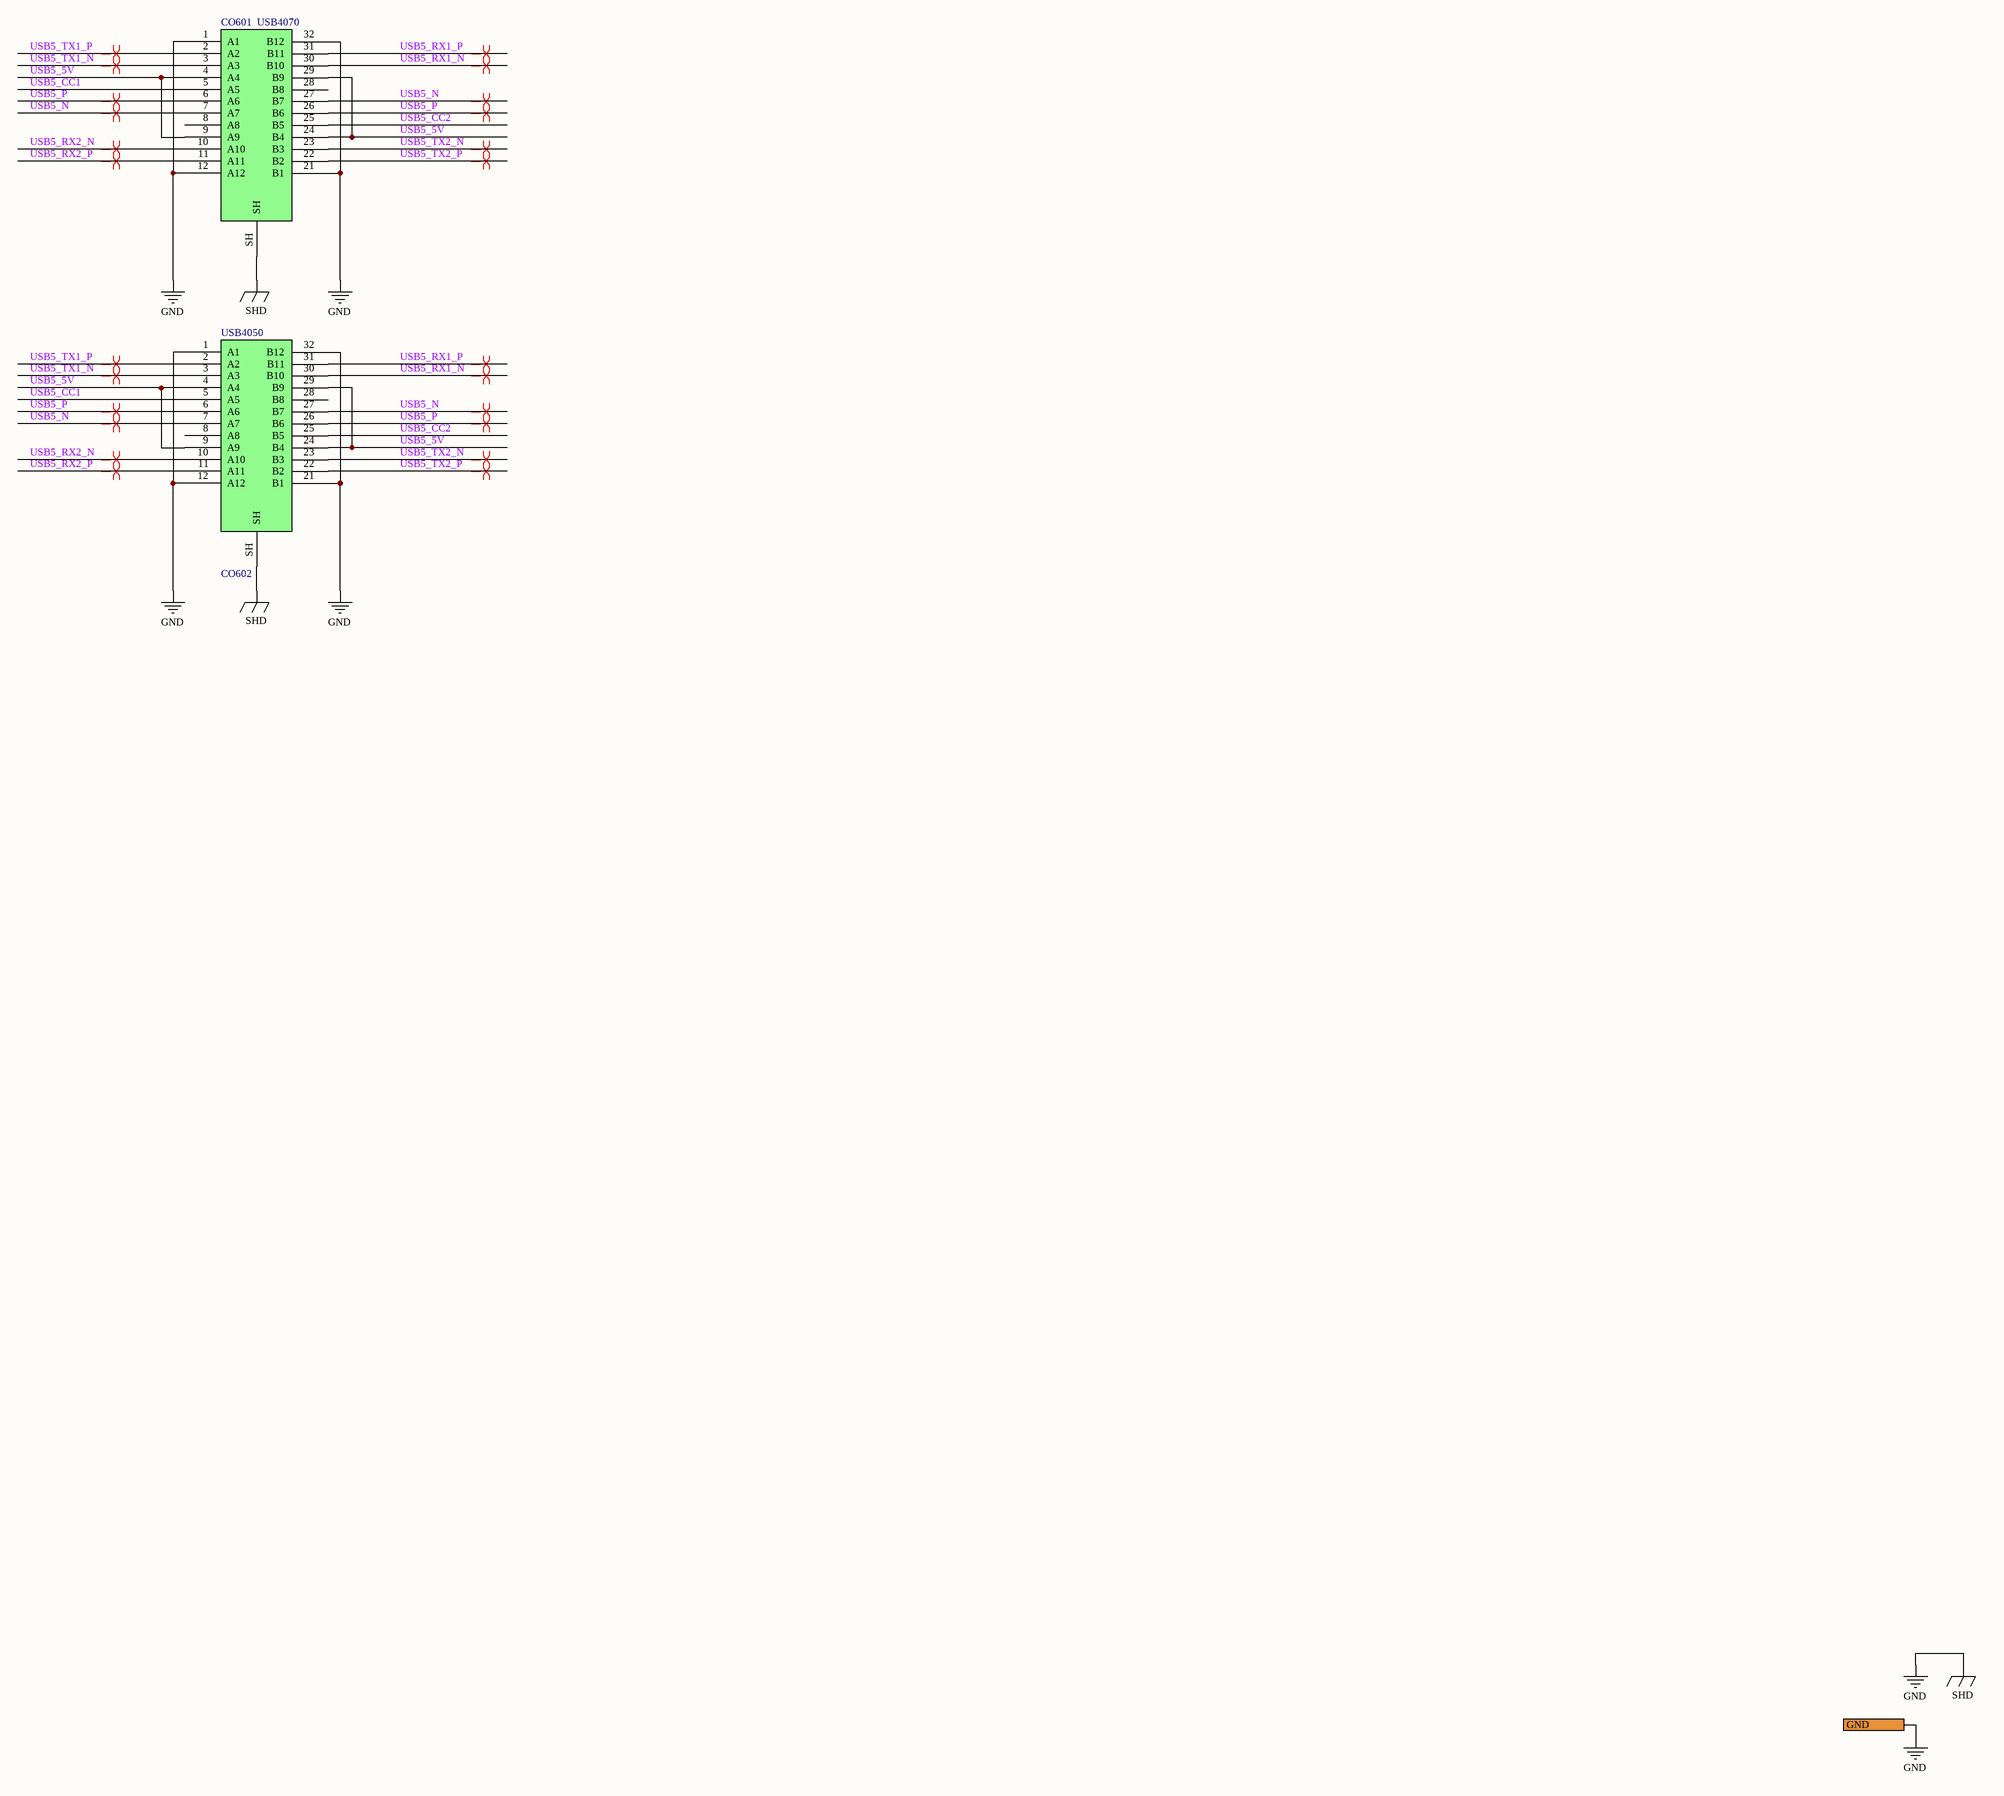
[diagram p7: 601_GridPos6.SchDoc]

### Parts
CO601  USB4070  [USB4070-30-C]
CO602  USB4050  [USB4050-30-A]

### Ports
GND

### Nets
GND: CO601.1(A1) CO601.12(A12) CO601.21(B1) CO601.32(B12) CO601.SH CO602.1(A1) CO602.12(A12) CO602.21(B1) CO602.32(B12) CO602.SH ; port GND  [also labelled SHD]
USB5_5V: CO601.4(A4) CO601.9(A9) CO601.24(B4) CO601.29(B9) CO602.4(A4) CO602.9(A9) CO602.24(B4) CO602.29(B9)
USB5_CC1: CO601.5(A5) CO602.5(A5)
USB5_CC2: CO601.25(B5) CO602.25(B5)
USB5_N: CO601.7(A7) CO601.27(B7) CO602.7(A7) CO602.27(B7)
USB5_P: CO601.6(A6) CO601.26(B6) CO602.6(A6) CO602.26(B6)
USB5_RX1_N: CO601.30(B10) CO602.30(B10)
USB5_RX1_P: CO601.31(B11) CO602.31(B11)
USB5_RX2_N: CO601.10(A10) CO602.10(A10)
USB5_RX2_P: CO601.11(A11) CO602.11(A11)
USB5_TX1_N: CO601.3(A3) CO602.3(A3)
USB5_TX1_P: CO601.2(A2) CO602.2(A2)
USB5_TX2_N: CO601.23(B3) CO602.23(B3)
USB5_TX2_P: CO601.22(B2) CO602.22(B2)

Not connected (* = marked no-connect by the designer): CO601 8(A8) 28(B8); CO602 8(A8) 28(B8)

### Layout directives
differential pair; differential pair class USB3: USB5_N, USB5_P, USB5_RX1_N, USB5_RX1_P, USB5_RX2_N, USB5_RX2_P, USB5_TX1_N, USB5_TX1_P, USB5_TX2_N, USB5_TX2_P

### Notes on the sheet
- Title
- Size:
- Date:
- File:
- A2
- Number:
- Time:
- Revision:
- Sheet
- of

### Library data of the parts
CO601 = CO0021: as CO101 on sheet 101_GridPos1; RefVal: USB4070; ManfactPart: USB4070-30-C
CO602 = CO0039: as CO202 on sheet 201_GridPos2; RefVal: USB4050; ManfactPart: USB4050-30-A

## Sheet 701_GridPos7.SchDoc: Grid Position 7 / USB 6
size A2; Organization: Greenfield Tech Solutions; Address1: Molendreef 33; Address2: Ossendrecht; Address3: 4641CS; Address4: The Netherlands; DocumentNumber: P234; Revision: 1.8; SheetNumber: 8; SheetTotal: 9
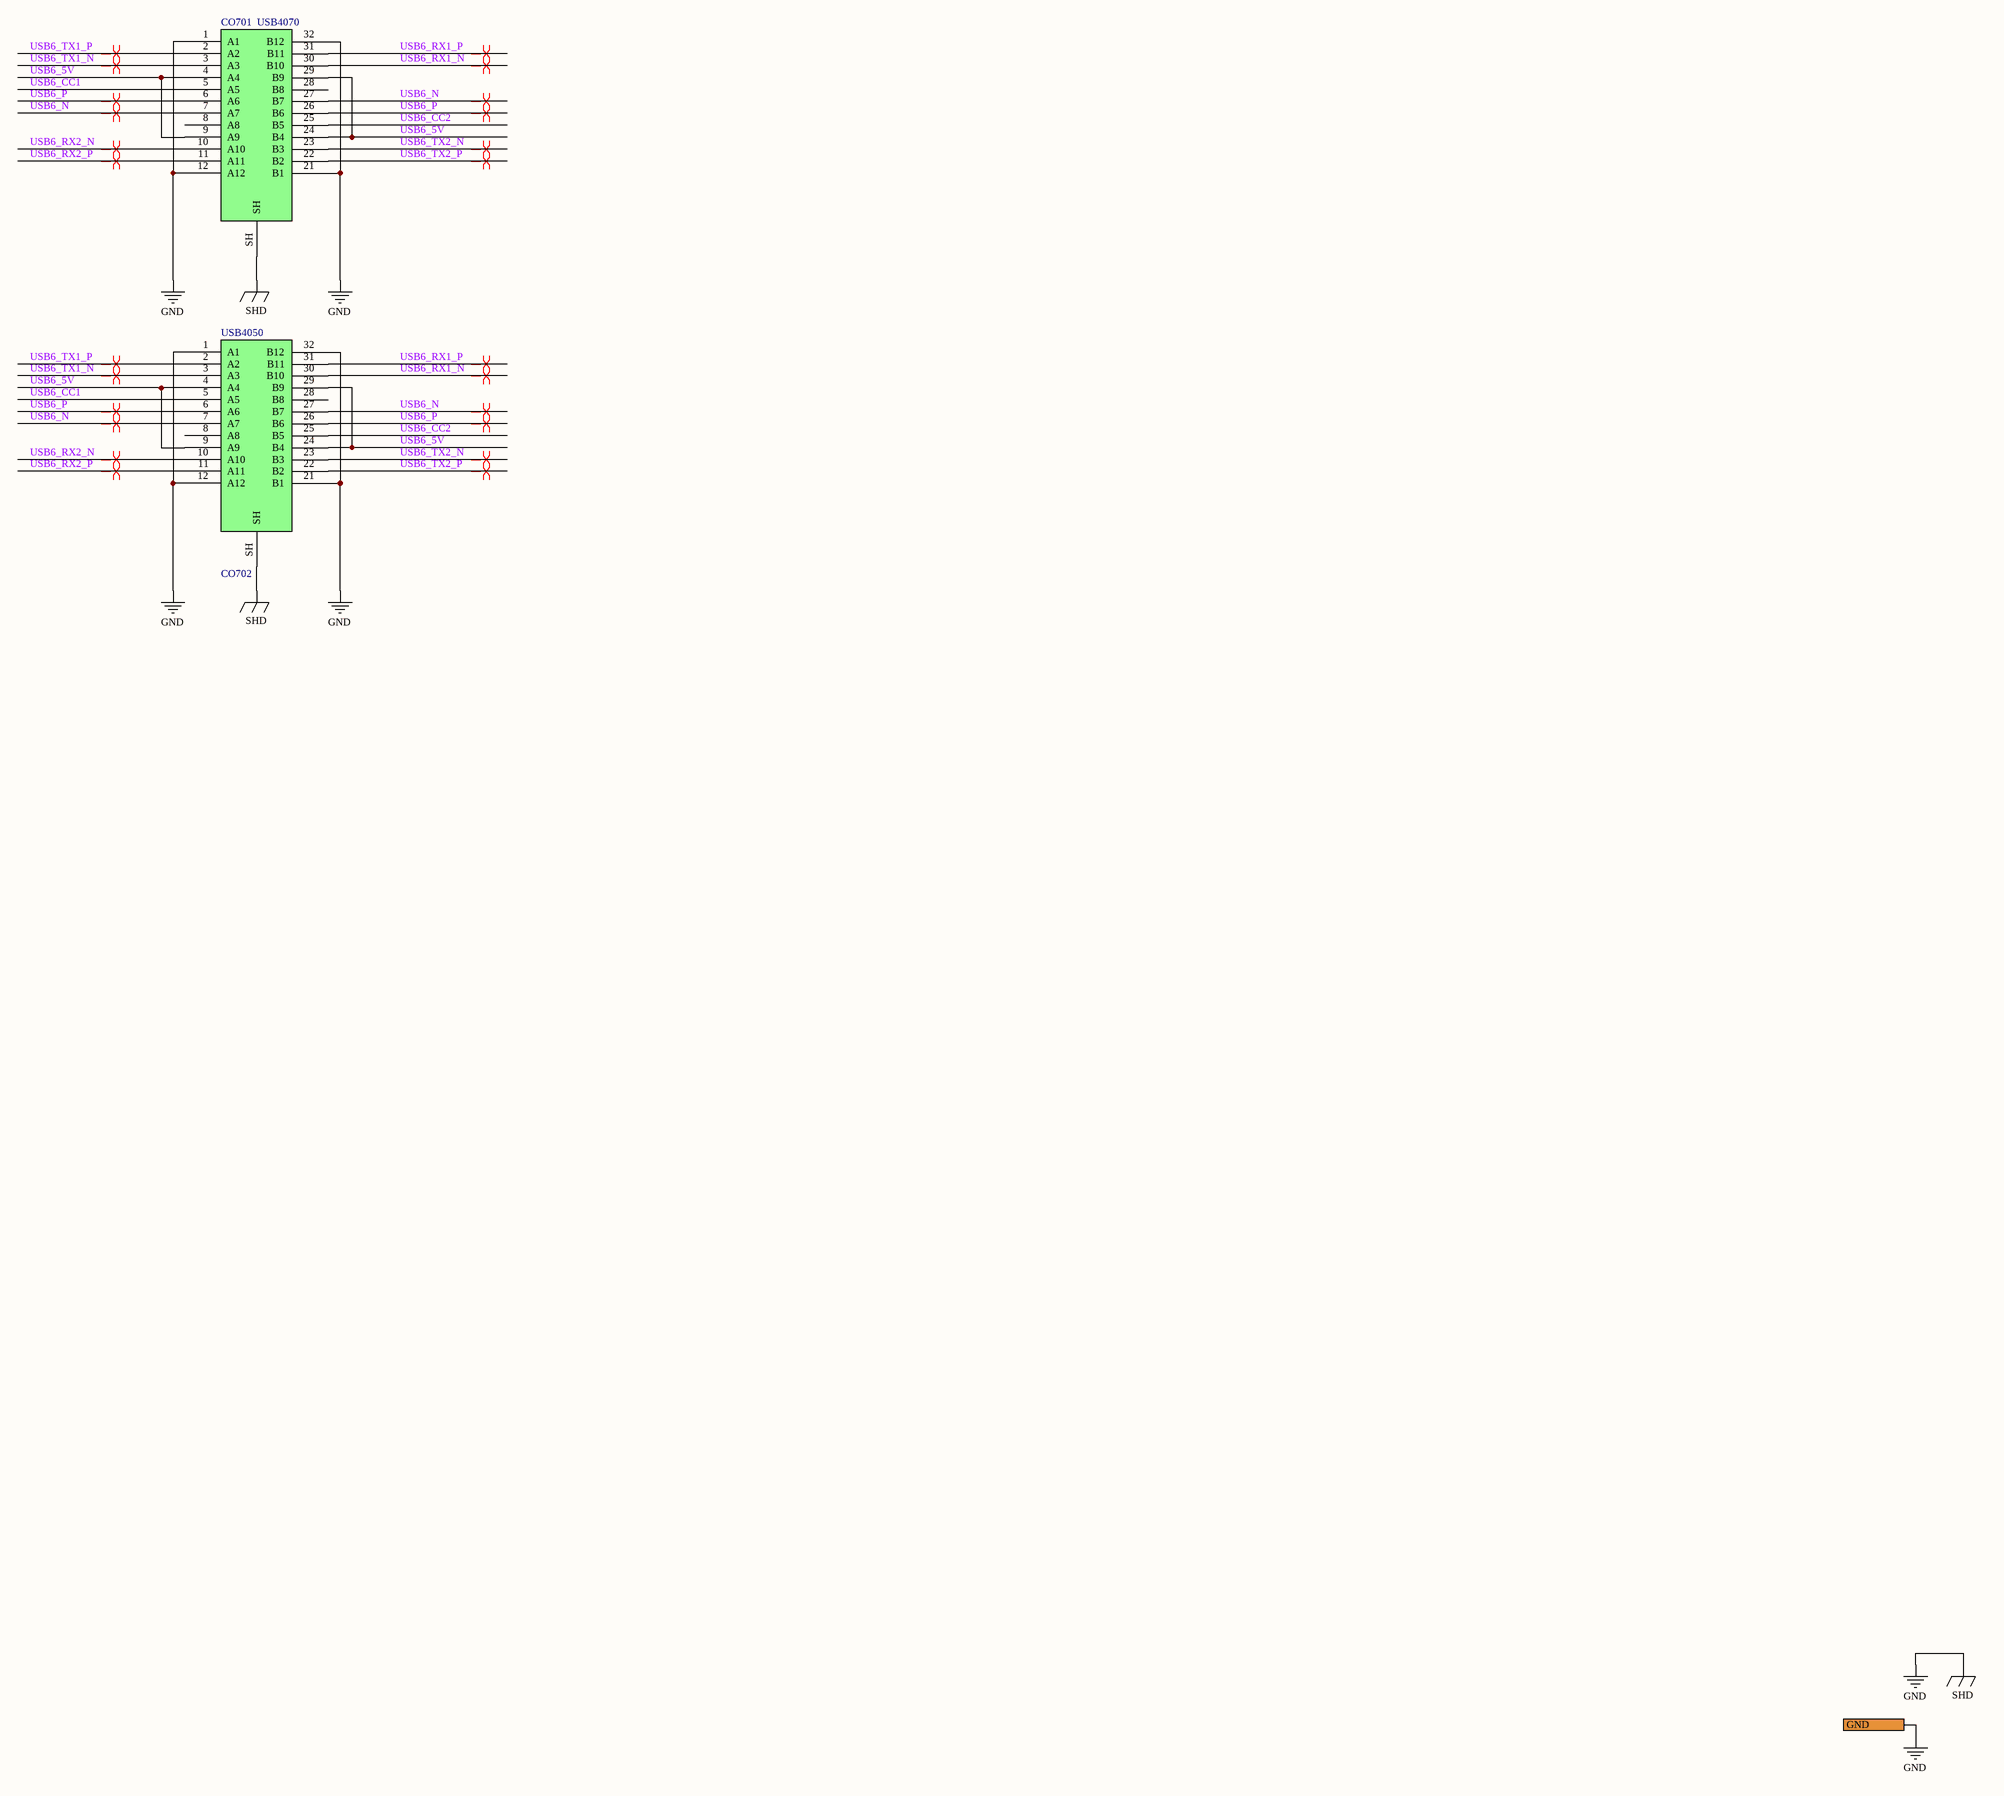
[diagram p8: 701_GridPos7.SchDoc]

### Parts
CO701  USB4070  [USB4070-30-C]
CO702  USB4050  [USB4050-30-A]

### Ports
GND

### Nets
GND: CO701.1(A1) CO701.12(A12) CO701.21(B1) CO701.32(B12) CO701.SH CO702.1(A1) CO702.12(A12) CO702.21(B1) CO702.32(B12) CO702.SH ; port GND  [also labelled SHD]
USB6_5V: CO701.4(A4) CO701.9(A9) CO701.24(B4) CO701.29(B9) CO702.4(A4) CO702.9(A9) CO702.24(B4) CO702.29(B9)
USB6_CC1: CO701.5(A5) CO702.5(A5)
USB6_CC2: CO701.25(B5) CO702.25(B5)
USB6_N: CO701.7(A7) CO701.27(B7) CO702.7(A7) CO702.27(B7)
USB6_P: CO701.6(A6) CO701.26(B6) CO702.6(A6) CO702.26(B6)
USB6_RX1_N: CO701.30(B10) CO702.30(B10)
USB6_RX1_P: CO701.31(B11) CO702.31(B11)
USB6_RX2_N: CO701.10(A10) CO702.10(A10)
USB6_RX2_P: CO701.11(A11) CO702.11(A11)
USB6_TX1_N: CO701.3(A3) CO702.3(A3)
USB6_TX1_P: CO701.2(A2) CO702.2(A2)
USB6_TX2_N: CO701.23(B3) CO702.23(B3)
USB6_TX2_P: CO701.22(B2) CO702.22(B2)

Not connected (* = marked no-connect by the designer): CO701 8(A8) 28(B8); CO702 8(A8) 28(B8)

### Layout directives
differential pair; differential pair class USB3: USB6_N, USB6_P, USB6_RX1_N, USB6_RX1_P, USB6_RX2_N, USB6_RX2_P, USB6_TX1_N, USB6_TX1_P, USB6_TX2_N, USB6_TX2_P

### Notes on the sheet
- Title
- Size:
- Date:
- File:
- A2
- Number:
- Time:
- Revision:
- Sheet
- of

### Library data of the parts
CO701 = CO0021: as CO101 on sheet 101_GridPos1; RefVal: USB4070; ManfactPart: USB4070-30-C
CO702 = CO0039: as CO202 on sheet 201_GridPos2; RefVal: USB4050; ManfactPart: USB4050-30-A

## Sheet 801_GridPos8.SchDoc: Grid Position 8 / USB 7
size A2; Organization: Greenfield Tech Solutions; Address1: Molendreef 33; Address2: Ossendrecht; Address3: 4641CS; Address4: The Netherlands; DocumentNumber: P234; Revision: 1.8; SheetNumber: 9; SheetTotal: 9
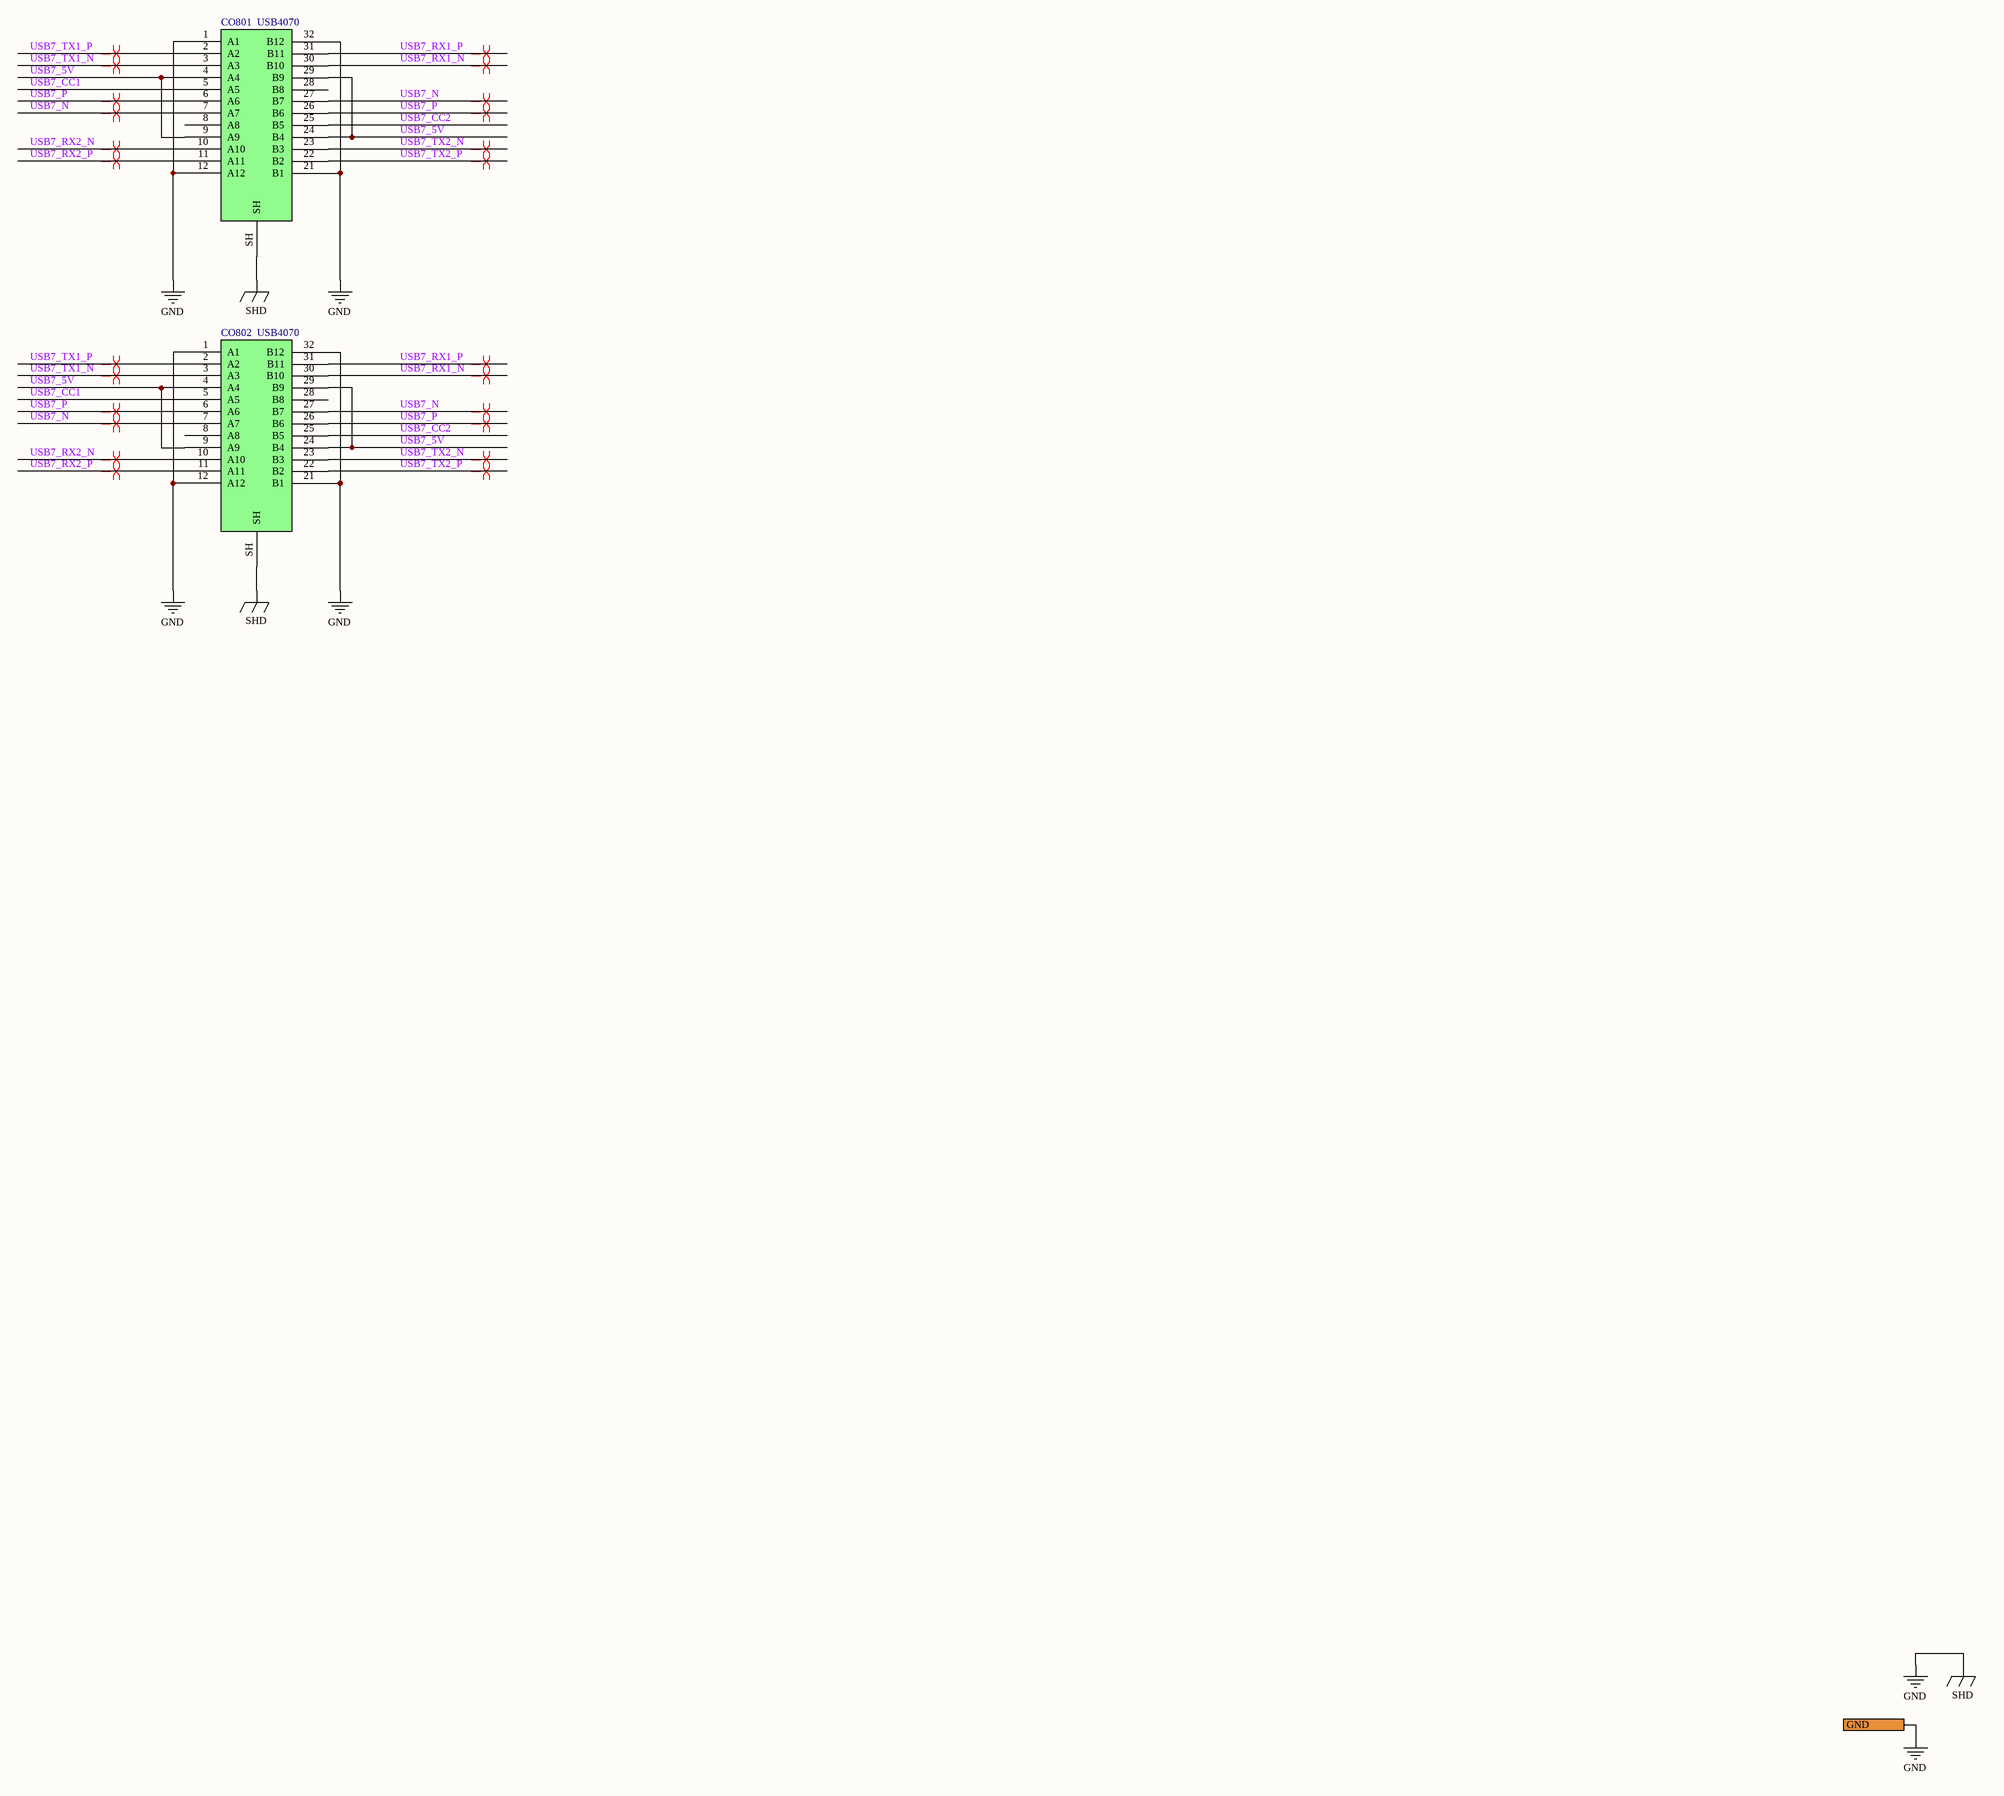
[diagram p9: 801_GridPos8.SchDoc]

### Parts
CO801  USB4070  [USB4070-30-C]
CO802  USB4070  [USB4070-30-C]

### Ports
GND

### Nets
GND: CO801.1(A1) CO801.12(A12) CO801.21(B1) CO801.32(B12) CO801.SH CO802.1(A1) CO802.12(A12) CO802.21(B1) CO802.32(B12) CO802.SH ; port GND  [also labelled SHD]
USB7_5V: CO801.4(A4) CO801.9(A9) CO801.24(B4) CO801.29(B9) CO802.4(A4) CO802.9(A9) CO802.24(B4) CO802.29(B9)
USB7_CC1: CO801.5(A5) CO802.5(A5)
USB7_CC2: CO801.25(B5) CO802.25(B5)
USB7_N: CO801.7(A7) CO801.27(B7) CO802.7(A7) CO802.27(B7)
USB7_P: CO801.6(A6) CO801.26(B6) CO802.6(A6) CO802.26(B6)
USB7_RX1_N: CO801.30(B10) CO802.30(B10)
USB7_RX1_P: CO801.31(B11) CO802.31(B11)
USB7_RX2_N: CO801.10(A10) CO802.10(A10)
USB7_RX2_P: CO801.11(A11) CO802.11(A11)
USB7_TX1_N: CO801.3(A3) CO802.3(A3)
USB7_TX1_P: CO801.2(A2) CO802.2(A2)
USB7_TX2_N: CO801.23(B3) CO802.23(B3)
USB7_TX2_P: CO801.22(B2) CO802.22(B2)

Not connected (* = marked no-connect by the designer): CO801 8(A8) 28(B8); CO802 8(A8) 28(B8)

### Layout directives
differential pair; differential pair class USB3: USB7_N, USB7_P, USB7_RX1_N, USB7_RX1_P, USB7_RX2_N, USB7_RX2_P, USB7_TX1_N, USB7_TX1_P, USB7_TX2_N, USB7_TX2_P

### Notes on the sheet
- Title
- Size:
- Date:
- File:
- A2
- Number:
- Time:
- Revision:
- Sheet
- of

### Library data of the parts
CO801 CO802 = CO0021: as CO101 on sheet 101_GridPos1; RefVal: USB4070; ManfactPart: USB4070-30-C

## Nets that join several sheets
GND: 100_top (8 pins), 101_GridPos1 (10 pins), 201_GridPos2 (10 pins), 401_GridPos4 (10 pins), 501_GridPos5 (10 pins), 301_GridPos3 (10 pins), 601_GridPos6 (10 pins), 701_GridPos7 (10 pins), 801_GridPos8 (10 pins)